# Altium project MAIN_BOARD.PrjPcb
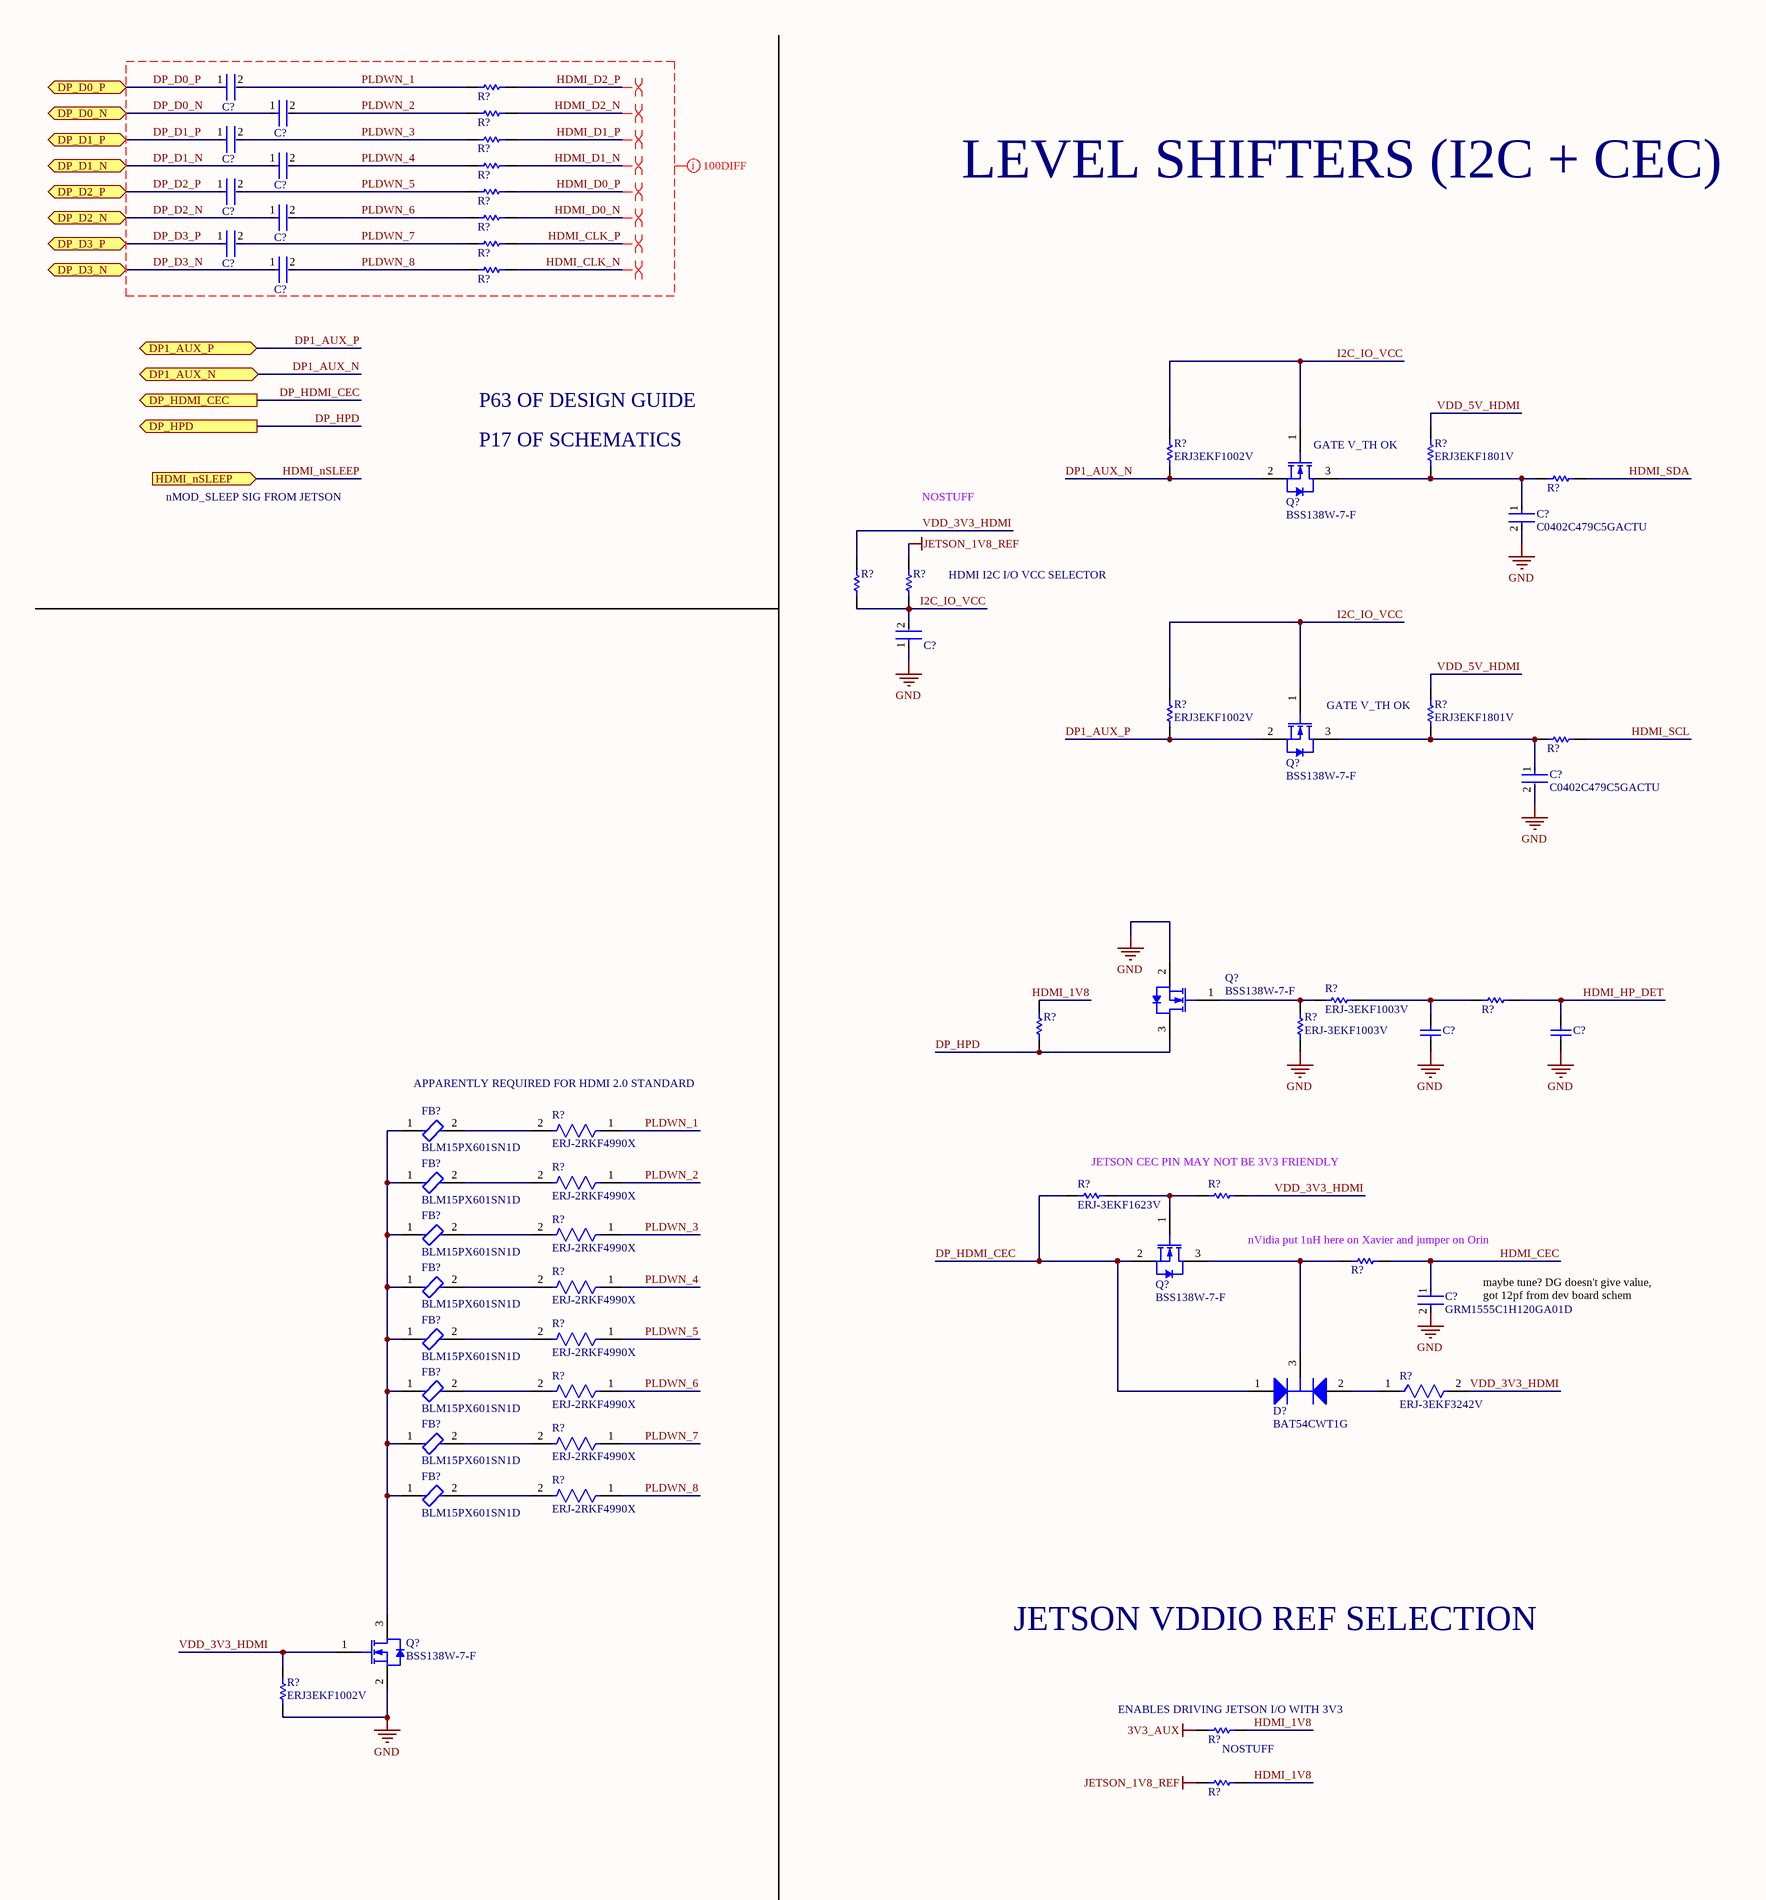
[diagram p0: HDMI.SchDoc, left]
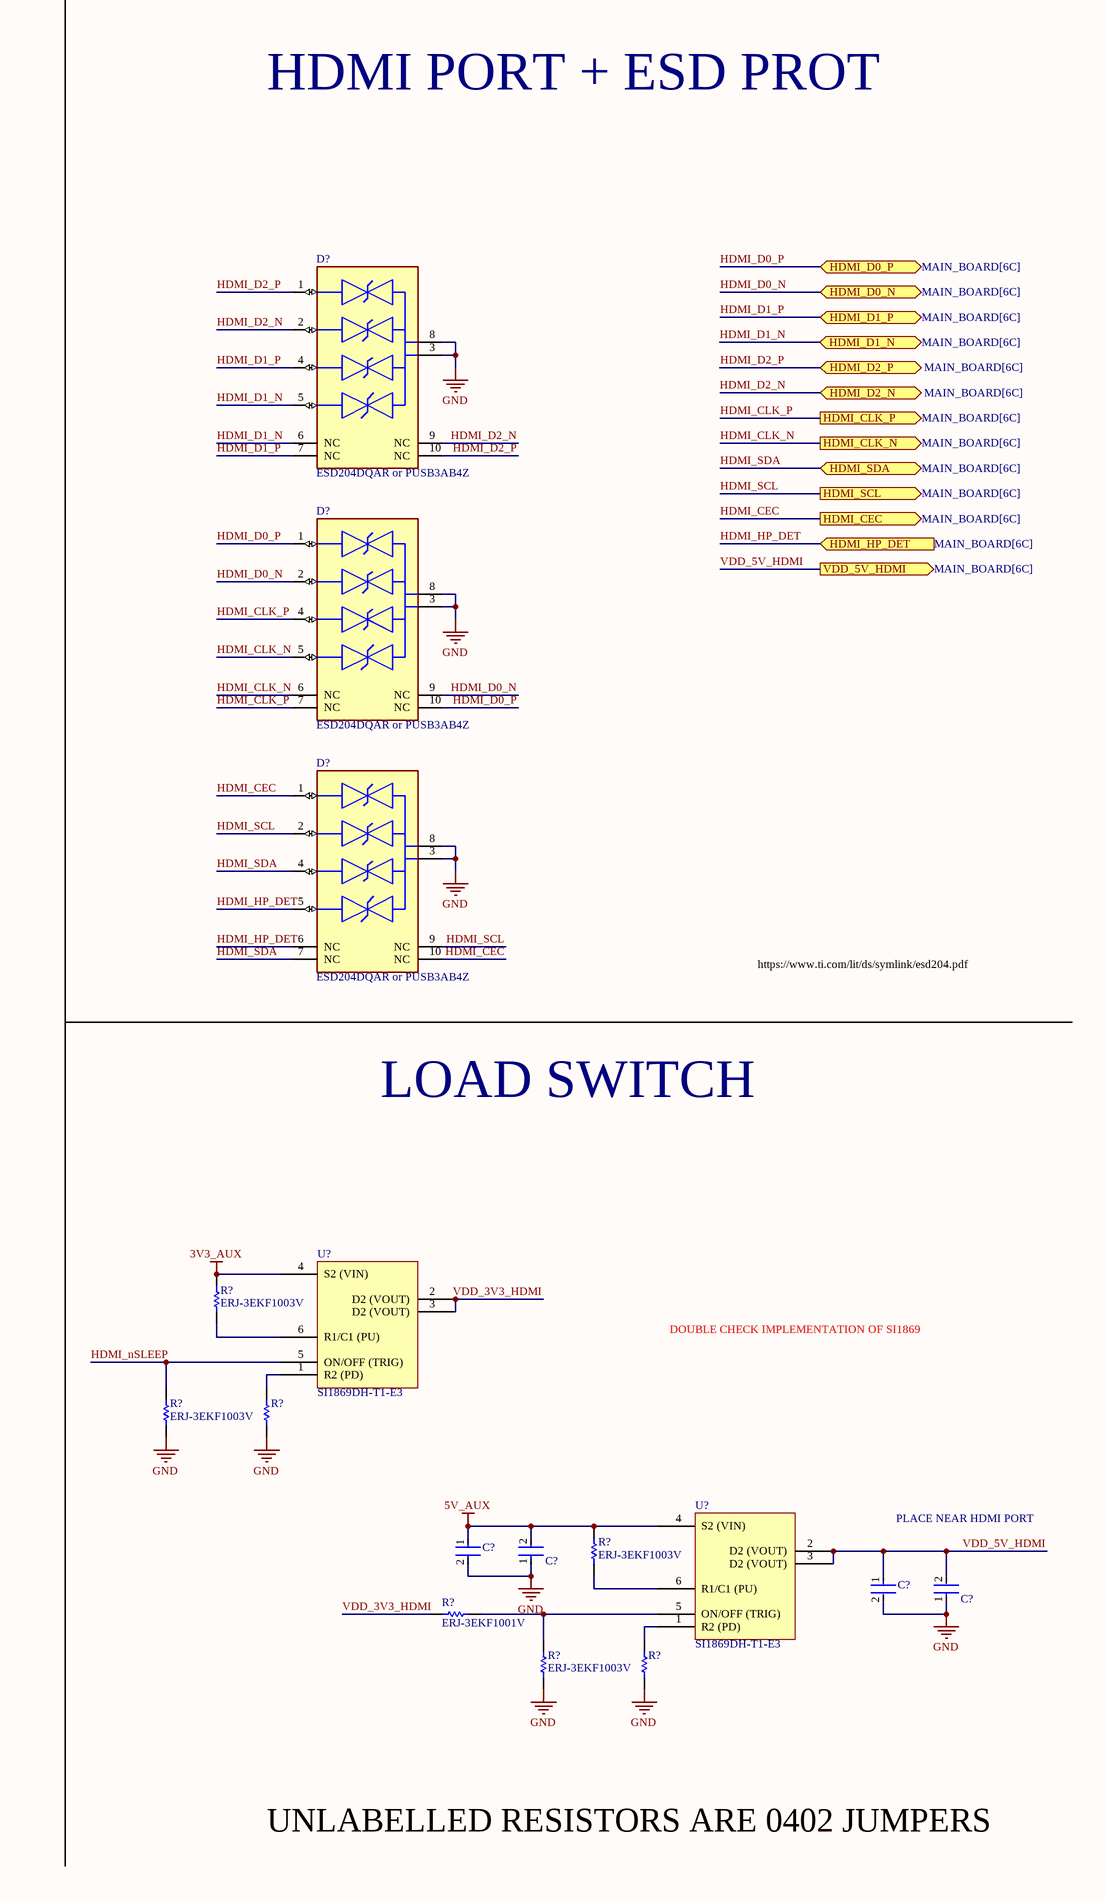
[diagram p1: HDMI.SchDoc, right]
3 sheets, 196 parts. Net scope: flat (ports and power ports of the same name join across sheets).
Board file: ADAS_ECU_MB_revA.PcbDoc
Sheets:
  HDMI.SchDoc
  GMSL_DESERIALIZER.SchDoc
  GMSL_SERIALIZER.SchDoc

## Sheet HDMI.SchDoc
size A2; SheetNumber: 3; SheetTotal: 10

### Parts
(Parts that share a designator on the sheet are numbered #1, #2 ... from top to bottom, then left to right.)
C?#1  C1005X7R1H104K050BB  [FP-C1005-050-0_05-IPC_C]  (value not drawn)
C?#2  C1005X7R1H104K050BB  [FP-C1005-050-0_05-IPC_C]  (value not drawn)
C?#3  C1005X7R1H104K050BB  [FP-C1005-050-0_05-IPC_C]  (value not drawn)
C?#4  C1005X7R1H104K050BB  [FP-C1005-050-0_05-IPC_C]  (value not drawn)
C?#5  C1005X7R1H104K050BB  [FP-C1005-050-0_05-IPC_C]  (value not drawn)
C?#6  C1005X7R1H104K050BB  [FP-C1005-050-0_05-IPC_C]  (value not drawn)
C?#7  C1005X7R1H104K050BB  [FP-C1005-050-0_05-IPC_C]  (value not drawn)
C?#8  C1005X7R1H104K050BB  [FP-C1005-050-0_05-IPC_C]  (value not drawn)
C?#9  C0402C479C5GACTU  [FP-C0402-BB-MFG]
C?#10  C1005X7R1H104K050BB  [FP-C1005-050-0_05-IPC_C]  (value not drawn)
C?#11  C0402C479C5GACTU  [FP-C0402-BB-MFG]
C?#12  C0402C221K5RAC7867  [CAPC1005X60X30NL05T10]  (value not drawn)
C?#13  C0402C221K5RAC7867  [CAPC1005X60X30NL05T10]  (value not drawn)
C?#14  GRM1555C1H120GA01D  [FP-GRM155-0_05-MFG]
C?#15  GRM188R60J106ME47D  [FP-GRM188-0_1-e0_2_0_55-IPC_A]  (value not drawn)
C?#16  C1005X7R1H104K050BB  [FP-C1005-050-0_05-IPC_C]  (value not drawn)
C?#17  GRM188R60J106ME47D  [FP-GRM188-0_1-e0_2_0_55-IPC_A]  (value not drawn)
C?#18  C1005X7R1H104K050BB  [FP-C1005-050-0_05-IPC_C]  (value not drawn)
D?#1  ESD204DQAR or PUSB3AB4Z  [FP-DQA0010A-MFG]
D?#2  ESD204DQAR or PUSB3AB4Z  [FP-DQA0010A-MFG]
D?#3  ESD204DQAR or PUSB3AB4Z  [FP-DQA0010A-MFG]
D?#4  BAT54CWT1G  [ONSC-SOT-323-3-419-04_V]
FB?#1  BLM15PX601SN1D  [FP-BLM15-0_05-MFG]
FB?#2  BLM15PX601SN1D  [FP-BLM15-0_05-MFG]
FB?#3  BLM15PX601SN1D  [FP-BLM15-0_05-MFG]
FB?#4  BLM15PX601SN1D  [FP-BLM15-0_05-MFG]
FB?#5  BLM15PX601SN1D  [FP-BLM15-0_05-MFG]
FB?#6  BLM15PX601SN1D  [FP-BLM15-0_05-MFG]
FB?#7  BLM15PX601SN1D  [FP-BLM15-0_05-MFG]
FB?#8  BLM15PX601SN1D  [FP-BLM15-0_05-MFG]
Q?#1  BSS138W-7-F  [DIOD-SOT323-3_V]
Q?#2  BSS138W-7-F  [DIOD-SOT323-3_V]
Q?#3  BSS138W-7-F  [DIOD-SOT323-3_V]
Q?#4  BSS138W-7-F  [DIOD-SOT323-3_V]
Q?#5  BSS138W-7-F  [DIOD-SOT323-3_V]
R?#1  0402 JUMPER  [RESC1005X40X25ML05T05]  (value not drawn)
R?#2  0402 JUMPER  [RESC1005X40X25ML05T05]  (value not drawn)
R?#3  0402 JUMPER  [RESC1005X40X25ML05T05]  (value not drawn)
R?#4  0402 JUMPER  [RESC1005X40X25ML05T05]  (value not drawn)
R?#5  0402 JUMPER  [RESC1005X40X25ML05T05]  (value not drawn)
R?#6  0402 JUMPER  [RESC1005X40X25ML05T05]  (value not drawn)
R?#7  0402 JUMPER  [RESC1005X40X25ML05T05]  (value not drawn)
R?#8  0402 JUMPER  [RESC1005X40X25ML05T05]  (value not drawn)
R?#9  ERJ3EKF1002V  [RESC1609X55X30LL15T15]
R?#10  ERJ3EKF1801V  [RESC1608X55X30LL15T15]
R?#11  0402 JUMPER  [RESC1005X40X25ML05T05]  (value not drawn)
R?#12  0402 JUMPER  [RESC1005X40X25ML05T05]  (value not drawn)
R?#13  0402 JUMPER  [RESC1005X40X25ML05T05]  (value not drawn)
R?#14  ERJ3EKF1002V  [RESC1609X55X30LL15T15]
R?#15  ERJ3EKF1801V  [RESC1608X55X30LL15T15]
R?#16  0402 JUMPER  [RESC1005X40X25ML05T05]  (value not drawn)
R?#17  ERJ-3EKF1003V  [RESC1608X55X30ML15T15]
R?#18  0402 JUMPER  [RESC1005X40X25ML05T05]  (value not drawn)
R?#19  ERJ3EKF1002V  [RESC1609X55X30LL15T15]  (value not drawn)
R?#20  ERJ-3EKF1003V  [RESC1608X55X30ML15T15]
R?#21  ERJ-2RKF4990X  [FP-ERJ2RK-MFG]
R?#22  ERJ-2RKF4990X  [FP-ERJ2RK-MFG]
R?#23  ERJ-3EKF1623V  [RESC1608X55X30ML15T15]
R?#24  0402 JUMPER  [RESC1005X40X25ML05T05]  (value not drawn)
R?#25  ERJ-2RKF4990X  [FP-ERJ2RK-MFG]
R?#26  0402 JUMPER  [RESC1005X40X25ML05T05]  (value not drawn)
R?#27  ERJ-2RKF4990X  [FP-ERJ2RK-MFG]
R?#28  ERJ-2RKF4990X  [FP-ERJ2RK-MFG]
R?#29  ERJ-2RKF4990X  [FP-ERJ2RK-MFG]
R?#30  ERJ-3EKF3242V  [FP-ERJ3EK-MFG]
R?#31  ERJ-3EKF1003V  [RESC1608X55X30ML15T15]
R?#32  ERJ-2RKF4990X  [FP-ERJ2RK-MFG]
R?#33  ERJ-2RKF4990X  [FP-ERJ2RK-MFG]
R?#34  0402 JUMPER  [RESC1005X40X25ML05T05]  (value not drawn)
R?#35  ERJ-3EKF1003V  [RESC1608X55X30ML15T15]
R?#36  ERJ-3EKF1003V  [RESC1608X55X30ML15T15]
R?#37  ERJ3EKF1002V  [RESC1609X55X30LL15T15]
R?#38  0402 JUMPER  [RESC1005X40X25ML05T05]  (value not drawn)
R?#39  ERJ-3EKF1001V  [RESC1608X55X30LL15T15]
R?#40  0402 JUMPER  [RESC1005X40X25ML05T05]  (value not drawn)
R?#41  0402 JUMPER  [RESC1005X40X25ML05T05]  (value not drawn)
R?#42  ERJ-3EKF1003V  [RESC1608X55X30ML15T15]
U?#1  SI1869DH-T1-E3  [SOT65P242X110-6N]
U?#2  SI1869DH-T1-E3  [SOT65P242X110-6N]

### Ports
DP1_AUX_N (bidir, see MAIN_BOARD[5C]), DP1_AUX_P (bidir, see MAIN_BOARD[5C]), DP_D0_N (bidir, see MAIN_BOARD[5C]), DP_D0_P (bidir, see MAIN_BOARD[5C]), DP_D1_N (bidir, see MAIN_BOARD[5C]), DP_D1_P (bidir, see MAIN_BOARD[5C]), DP_D2_N (bidir, see MAIN_BOARD[5C]), DP_D2_P (bidir, see MAIN_BOARD[5C]), DP_D3_N (bidir, see MAIN_BOARD[5C]), DP_D3_P (bidir, see MAIN_BOARD[5C]), DP_HDMI_CEC (out, see MAIN_BOARD[5C]), DP_HPD (out, see MAIN_BOARD[5C]), HDMI_CEC (out, see MAIN_BOARD[6C]), HDMI_CLK_N (out, see MAIN_BOARD[6C]), HDMI_CLK_P (out, see MAIN_BOARD[6C]), HDMI_D0_N (bidir, see MAIN_BOARD[6C]), HDMI_D0_P (bidir, see MAIN_BOARD[6C]), HDMI_D1_N (bidir, see MAIN_BOARD[6C]), HDMI_D1_P (bidir, see MAIN_BOARD[6C]), HDMI_D2_N (bidir, see MAIN_BOARD[6C]), HDMI_D2_P (bidir, see MAIN_BOARD[6C]), HDMI_HP_DET (in, see MAIN_BOARD[6C]), HDMI_nSLEEP (in, see MAIN_BOARD[5C]), HDMI_SCL (out, see MAIN_BOARD[6C]), HDMI_SDA (bidir, see MAIN_BOARD[6C]), VDD_5V_HDMI (out, see MAIN_BOARD[6C])

### Nets
3V3_AUX: R?#31.2 R?#38.1 U?#1.4(S2_(VIN))
5V_AUX: C?#15.1 C?#16.2 R?#36.2 U?#2.4(S2_(VIN))
GND: C?#9.2 C?#10.1 C?#11.2 C?#12.1 C?#13.1 C?#14.2 C?#15.2 C?#16.1 C?#17.2 C?#18.1 D?#1.3(GND) D?#1.8(GND) D?#2.3(GND) D?#2.8(GND) D?#3.3(GND) D?#3.8(GND) Q?#3.2(S) Q?#5.2(S) R?#20.1 R?#34.2 R?#35.1 R?#37.1 R?#41.2 R?#42.1
JETSON_1V8_REF: R?#13.2 R?#40.1
DP1_AUX_N: Q?#1.2(S) R?#9.1 ; port DP1_AUX_N
DP1_AUX_P: Q?#2.2(S) R?#14.1 ; port DP1_AUX_P
DP_D0_N: C?#2.1 ; port DP_D0_N
DP_D0_P: C?#1.1 ; port DP_D0_P
DP_D1_N: C?#4.1 ; port DP_D1_N
DP_D1_P: C?#3.1 ; port DP_D1_P
DP_D2_N: C?#6.1 ; port DP_D2_N
DP_D2_P: C?#5.1 ; port DP_D2_P
DP_D3_N: C?#8.1 ; port DP_D3_N
DP_D3_P: C?#7.1 ; port DP_D3_P
DP_HDMI_CEC: D?#4.1(A1) Q?#4.2(S) R?#23.1 ; port DP_HDMI_CEC
DP_HPD: Q?#3.3(D) R?#19.1 ; port DP_HPD
HDMI_1V8: R?#19.2 R?#38.2 R?#40.2
HDMI_CEC: C?#14.1 D?#3.1(IO1) D?#3.10(NC) R?#26.2 ; port HDMI_CEC
HDMI_CLK_N: D?#2.5(IO4) D?#2.6(NC) R?#8.2 ; port HDMI_CLK_N
HDMI_CLK_P: D?#2.4(IO3) D?#2.7(NC) R?#7.2 ; port HDMI_CLK_P
HDMI_D0_N: D?#2.2(IO2) D?#2.9(NC) R?#6.2 ; port HDMI_D0_N
HDMI_D0_P: D?#2.1(IO1) D?#2.10(NC) R?#5.2 ; port HDMI_D0_P
HDMI_D1_N: D?#1.5(IO4) D?#1.6(NC) R?#4.2 ; port HDMI_D1_N
HDMI_D1_P: D?#1.4(IO3) D?#1.7(NC) R?#3.2 ; port HDMI_D1_P
HDMI_D2_N: D?#1.2(IO2) D?#1.9(NC) R?#2.2
HDMI_D2_P: D?#1.1(IO1) D?#1.10(NC) R?#1.2 ; port HDMI_D2_P
HDMI_HP_DET: C?#13.2 D?#3.5(IO4) D?#3.6(NC) R?#18.2 ; port HDMI_HP_DET
HDMI_nSLEEP: R?#35.2 U?#1.5(ON/OFF_(TRIG)) ; port HDMI_nSLEEP
HDMI_SCL: D?#3.2(IO2) D?#3.9(NC) R?#16.2 ; port HDMI_SCL
HDMI_SDA: D?#3.4(IO3) D?#3.7(NC) R?#11.2 ; port HDMI_SDA
I2C_IO_VCC: C?#10.2 Q?#1.1(G) Q?#2.1(G) R?#9.2 R?#12.1 R?#13.1 R?#14.2
PLDWN_1: C?#1.2 R?#1.1 R?#21.1
PLDWN_2: C?#2.2 R?#2.1 R?#22.1
PLDWN_3: C?#3.2 R?#3.1 R?#25.1
PLDWN_4: C?#4.2 R?#4.1 R?#27.1
PLDWN_5: C?#5.2 R?#5.1 R?#28.1
PLDWN_6: C?#6.2 R?#6.1 R?#29.1
PLDWN_7: C?#7.2 R?#7.1 R?#32.1
PLDWN_8: C?#8.2 R?#8.1 R?#33.1
VDD_3V3_HDMI: Q?#5.1(G) R?#12.2 R?#24.1 R?#30.2 R?#37.2 R?#39.1 U?#1.2(D2_(VOUT)) U?#1.3(D2_(VOUT))
VDD_5V_HDMI: C?#17.1 C?#18.2 R?#10.2 R?#15.2 U?#2.2(D2_(VOUT)) U?#2.3(D2_(VOUT)) ; port VDD_5V_HDMI
NetC?#9_1: C?#9.1 Q?#1.3(D) R?#10.1 R?#11.1
NetC?#11_1: C?#11.1 Q?#2.3(D) R?#15.1 R?#16.1
NetC?#12_2: C?#12.2 R?#17.2 R?#18.1
NetD?#4_2: D?#4.2(A2) R?#30.1
NetD?#4_3: D?#4.3(K) Q?#4.3(D) R?#26.1
NetFB?#1_1: FB?#1.1 FB?#2.1 FB?#3.1 FB?#4.1 FB?#5.1 FB?#6.1 FB?#7.1 FB?#8.1 Q?#5.3(D)
NetFB?#1_2: FB?#1.2 R?#21.2
NetFB?#2_2: FB?#2.2 R?#22.2
NetFB?#3_2: FB?#3.2 R?#25.2
NetFB?#4_2: FB?#4.2 R?#27.2
NetFB?#5_2: FB?#5.2 R?#28.2
NetFB?#6_2: FB?#6.2 R?#29.2
NetFB?#7_2: FB?#7.2 R?#32.2
NetFB?#8_2: FB?#8.2 R?#33.2
NetQ?#3_1: Q?#3.1(G) R?#17.1 R?#20.2
NetQ?#4_1: Q?#4.1(G) R?#23.2 R?#24.2
NetR?#31_1: R?#31.1 U?#1.6(R1/C1_(PU))
NetR?#34_1: R?#34.1 U?#1.1(R2_(PD))
NetR?#36_1: R?#36.1 U?#2.6(R1/C1_(PU))
NetR?#39_2: R?#39.2 R?#42.2 U?#2.5(ON/OFF_(TRIG))
NetR?#41_1: R?#41.1 U?#2.1(R2_(PD))

### Layout directives
differential pair; differential pair class 100DIFF: HDMI_CLK_N, HDMI_CLK_P, HDMI_D0_N, HDMI_D0_P, HDMI_D1_N, HDMI_D1_P, HDMI_D2_N, HDMI_D2_P
net class 100DIFF: DP_D0_N, DP_D0_P, DP_D1_N, DP_D1_P, DP_D2_N, DP_D2_P, DP_D3_N, DP_D3_P, HDMI_CLK_N, HDMI_CLK_P, HDMI_D0_N, HDMI_D0_P, HDMI_D1_N, HDMI_D1_P, HDMI_D2_N, HDMI_D2_P, PLDWN_1, PLDWN_2, PLDWN_3, PLDWN_4, PLDWN_5, PLDWN_6, PLDWN_7, PLDWN_8

### Notes on the sheet
- HDMI PORT + ESD PROT
- LEVEL SHIFTERS (I2C + CEC)
- P63 OF DESIGN GUIDE
- nMOD_SLEEP SIG FROM JETSON
- P17 OF SCHEMATICS
- NOSTUFF
- (near Q?#1) GATE V_TH OK
- HDMI I2C I/O VCC SELECTOR
- (near Q?#2) GATE V_TH OK
- APPARENTLY REQUIRED FOR HDMI 2.0 STANDARD
- https://www.ti.com/lit/ds/symlink/esd204.pdf
- (near R?#23) JETSON CEC PIN MAY NOT BE 3V3 FRIENDLY
- LOAD SWITCH
- (near R?#26) nVidia put 1nH here on Xavier and jumper on Orin
- maybe tune? DG doesn't give value, got 12pf from dev board schem
- DOUBLE CHECK IMPLEMENTATION OF SI1869
- JETSON VDDIO REF SELECTION
- PLACE NEAR HDMI PORT
- (near R?#38) ENABLES DRIVING JETSON I/O WITH 3V3
- (near R?#38) NOSTUFF
- UNLABELLED RESISTORS ARE 0402 JUMPERS
- Labels drawn without touching a wire or pin: HDMI_D2_N

### Library data of the parts
C?#1-C?#8 C?#10 C?#16 C?#18 = CMP-2000-05393-2: Multilayer Ceramic Capacitors 100nF ±10% 50V X7R SMD 0402; Voltage: 50V; Dielectric Material: Ceramic; Min Operating Temperature: -55°C; Depth: 0.5mm; Radiation Hardening: No; RoHS Compliant: Yes; Voltage Rating (DC): 50V; Lead Free: Lead Free; Resistor Type: Ceramic; Height: 0.5mm; Dielectric: X7R; Thickness: 0.022inch; Case/Package: 0402; Case Code (Metric): 1005; Termination: SMD/SMT; Capacitance: 100nF; Packaging: Tape and Reel; Max Operating Temperature: 125°C; Mount: Surface Mount; Package Quantity: 1; Width: 0.02inch; Weight: 2.3E-05oz; Voltage Rating: 50V; Tolerance: 10%; Construction: Flat; Case Code (Imperial): 0402; Length: 1mm; REACH SVHC: No SVHC; Series: C
C?#9 C?#11 = CMP-2008-03310-2: CAP CER 4.7PF 50V NP0 0402; Manufacturer: Kemet; Material: Ceramic; Tolerance: 0.25 pF; Temperature Coefficient: 15%; Temperature Characteristic: C0G; Manufacturer Part Number: C0402C479C5GACTU; Lead Free: Yes; Device Class L1: Passive Components; ComponentLink2Description: Datasheet; Temperature: -55°C to +125°C; Digikey Description: CAP CER 4.7PF 50V NP0 0402; Ipc Land Pattern Name: CAPC10050X50; ComponentLink2URL: https://content.kemet.com/datasheets/KEM_C1002_X7R_SMD.pdf; Octopart: https://octopart.com/c0402c479c5gactu-kemet-9144199; Mouser Description: Multilayer Ceramic Capacitors MLCC - SMD/SMT 50volts 4.7pF C0G .25pF; Automotive: No; Voltage Rating: 50 V; Device Class L3: Ceramic Capacitors; Capacitance: 4.7 pF; Category: Cap; Value: 4.7 pF; Package: C0402-BB; Height: 0.55mm; Temperature Range Low: -55°C; RoHS: TRUE; Device Class L2: Capacitors; Temperature Range High: +125°C
C?#12 C?#13 = CMP-2008-03137-2: Manufacturer: Kemet; Part Number: C0402C221K5RAC7867
C?#14 = CMP-2008-03945-2: CAP CER 12PF 50V C0G/NP0 0402; Tolerance: 2%; Dielectric: C0G; Material: Ceramic; Termination: SMD/SMT; Mount: Surface Mount; REACH SVHC: No SVHC; Depth: 0.5mm; Case Code (Metric): 1005; Voltage Rating: 50V; Height: 0.5mm; Voltage Rating (DC): 50V; Case Code (Imperial): 0402; Package Quantity: 10000; Construction: Flat; Thickness: 0.022inch; Length: 1mm; Min Operating Temperature: -55°C; Width: 0.5mm; Lead Free: Lead Free; Capacitance: 12pF; Case/Package: 0402; Packaging: Tape and Reel; Series: GRM; Voltage: 50V; Radiation Hardening: No; Max Operating Temperature: 125°C
C?#15 C?#17 = CMP-2006-02792-2: Chip Multilayer Ceramic Capacitors for General Purpose, 0603, 10uF, X5R, 15%, 20%, 6.3V; Packaging: Tape and Reel; Voltage Rating (DC): 6.3V; Width: 0.031inch; Termination: SMD/SMT; Dielectric: X5R; Package Quantity: 4000; Voltage Rating: 6.3V; Capacitance: 10uF; Case/Package: 0603; Min Operating Temperature: -55°C; Voltage: 6.3V; Length: 1.6mm; Thickness: 0.035inch; Lead Free: Lead Free; Depth: 0.8mm; Case Code (Imperial): 0603; Max Operating Temperature: 85°C; Material: Ceramic; Height: 0.8mm; Tolerance: 20%; Mount: Surface Mount; REACH SVHC: No SVHC; Radiation Hardening: No; Case Code (Metric): 1608
D?#1-D?#3 = CMP-04989-000002-1: 4-CHANNEL LOW-CAPACITANCE SURGE; Manufacturer: Texas Instruments; Value: 0.55pF; Reverse Standoff Voltage: 3.6V; Standoff Height: 0mm; Breakdown Voltage: 5.5V; Peak Pulse Current: 5.5A; Clamping Voltage: 11.5V; Direction: Bidirectional; Peak Pulse Power: 50W; Number Of Channels: 4; Ambient Temperature Range High: +125°C; ComponentLink2Description: Datasheet; Height: 0.55mm; Lead Free: Yes; Device Class L3: unset; Temperature Range High: +125°C; Temperature Range Low: -40°C; Package: DQA0010A; Temperature: -40°C to +125°C; Capacitance: 0.55pF; RoHS: TRUE; Mouser Description: 4-Channel Low-Capacitance Surge and ESD Protection Diode 10-USON -40 to 125; Category: Diode; Device Class L1: Circuit Protection; Octopart: https://octopart.com/esd204dqar-texas+instruments-89917476; Device Class L2: TVS Diodes; Ambient Temperature Range Low: -40°C; Manufacturer Part Number: ESD204DQAR; ComponentLink2URL: http://www.ti.com/lit/ds/symlink/esd204.pdf; Automotive: No; Digikey Description: 4-CHANNEL LOW-CAPACITANCE SURGE
D?#4 = CMP-1055-00557-1: Dual Series Cathode Schottky Barrier Diodes, 3-Pin SOT-323, Pb-Free, Tape and Reel; Manufacturer: On Semiconductor; Configuration: Common Cathode; IFSM Max (A): 0.6; trr Max (ns): 5; ComponentLink2Description: Datasheet; Packing: Tape and Reel; ComponentLink3Description: Package Specification; Mounting Technology: Surface Mount; PartNumber: BAT54CWT1G; PackageVersion: Rev. N, 11/2008; RoHS: TRUE; ComponentLink3URL: http://www.onsemi.com/pub_link/Collateral/419-04.PDF; ComponentLink2URL: http://www.onsemi.cn/pub_link/Collateral/BAT54CWT1-D.PDF; PackageReference: SOT-323-3-419-04; ComponentLink1URL: http://www.onsemi.com/; ComponentLink1Description: Manufacturer URL; DatasheetVersion: Rev. 7; PackageDescription: 3-Pin Small Outline Transistor, Body 2 x 1.25 mm, Pitch 0.65 mm
FB?#1-FB?#8 = CMP-0686-00252-4: Chip Ferrite Bead, 0402, 600Ω @ 100MHz, 0.23Ω, 25%, 900mA; Number of Circuits: 1; Impedance: 600R; DC Resistance (DCR): 230mR; Material: Steel; Length: 1mm; Package Quantity: 10000; Height: 0.5mm; Width: 0.5mm; Max DC Current: 900mA; Number of Lines: 1; Termination: SMD/SMT; Packaging: Tape and Reel; Lead Free: Lead Free; Min Operating Temperature: -55°C; Max Operating Temperature: 125°C; Max Current Rating: 900mA; Case Code (Imperial): 0402; Number of Pins: 2; Current Rating: 900mA; Test Frequency: 100MHz; Case/Package: 0402; Tolerance: 25%; Case Code (Metric): 1005
Q?#1-Q?#5 = CMP-2000-05968-1: N-Channel Enhancement Mode Mosfet, 50 V, 200 mA, -55 to 150 degC, 6-Pin SOT-323, RoHS, Tape and Reel; Typical Turn-Off Delay Time: 20ns; Number of Channels: 1Channel; Type: EnhancementModeFieldEffectTransistor; Brand: DiodesIncorporated; Vds - Drain-Source Breakdown Voltage: 75V; Vgs - Gate-Source Voltage: 20V; Rds On - Drain-Source Resistance: 1.4Ohms; Transistor Type: 1N-Channel; Configuration: Single; Unit Weight: 0.000212oz; Pd - Power Dissipation: 200mW; Id - Continuous Drain Current: 200mA; Forward Transconductance - Min: 0.1S; Manufacturer URL: http://www.diodes.com/; Series: BSS138; Package Description: 3-Pin Small Outline Transistor, Body 2 x 1.25 mm, Pitch 0.65 mm; Mounting Technology: SurfaceMount; Product Category: MOSFET; RoHS: True; Maximum Operating Temperature: +150C; Height: 1mm; Length: 2.2mm; Technology: Si; Width: 1.35mm; Datasheet URL: http://www.diodes.com/_files/datasheets/ds30206.pdf; Manufacturer: DiodesIncorporated; Package / Case: SOT-323-3; Typical Turn-On Delay Time: 20ns; Transistor Polarity: N-Channel; Factory Pack Quantity: 3000; Packaging: Reel; Product: MOSFETSmallSignal; Datasheet Version: Rev. 11-2, 09/2013; Package Reference: SOT323; Minimum Operating Temperature: -55C; Mounting Style: SMD/SMT; Channel Mode: Enhancement
R?#1-R?#8 R?#11-R?#13 R?#16 R?#18 R?#24 R?#26 R?#34 R?#38 R?#40 R?#41 = CMP-009-00118-2: READ THE NAME; Pins: 2; Component Type: Standard; Design Item ID: CMP-009-00206-2; Source: 0402jump.SchLib
R?#9 R?#14 R?#19 R?#37 = CMP-1012-00623-3: Chip Resistor, 10 KOhm, +/- 1%, 0.1 W, -55 to 155 degC, 0603 (1608 Metric), RoHS, Tape and Reel; Manufacturer: Panasonic; Voltage Rating: 75V; Case\/Package: 0603; Power Rating: 100mW; Resistance: 10KOhm; Temperature Coefficient: 100ppm\/degreesC; Number of Pins: 2; Package Reference: 603; Depth: 0.8mm; Mount: SurfaceMount; Package Description: 2-Pin Surface Mount Device, Body 1.6 x 0.85 mm; Datasheet Version: 02/2017; Length: 1.6mm; Lead Free: LeadFree; Height: 0.45mm; Number of Terminations: 2; Max Power Dissipation: 100mW; Min Operating Temperature: -55degC; Datasheet URL: https://industrial.panasonic.com/cdbs/www-data/pdf/RDA0000/AOA0000C304.pdf; Termination: SMD/SMT; Case Code (Metric): 1608; Case Code (Imperial): 0603; Tolerance: 1%; Max Operating Temperature: 155degC; RoHSCompliant: true; Voltage Rating (DC): 75V; Radiation Hardening: No; Packaging: TapeandReel; Composition: ThickFilm; Mounting Technology: SurfaceMount; Manufacturer URL: http://www.panasonic.com/; Width: 0.031inch; REACH SVHC: NoSVHC; Contact Plating: Tin; Military Standard: Not; Package Quantity: 1
R?#10 R?#15 = CMP-2000-00389-1: MODIFIED P/N; Manufacturer: Panasonic; Part Number: ERJ3EKF2701V
R?#17 R?#20 R?#31 R?#35 R?#36 R?#42 = CMP-2000-00182-1: Manufacturer: Panasonic; Part Number: ERJ-3EKF1003V
R?#21 R?#22 R?#25 R?#27-R?#29 R?#32 R?#33 = CMP-2002-00965-2: RES SMD 499 OHM 1% 1/10W 0402; Temperature Coefficient: 100ppm/°C; Max Power Dissipation: 100mW; Voltage Rating (DC): 50V; Resistance: 499R; Technology: THICK FILM; Min Operating Temperature: -55°C; Package Quantity: 1; Width: 0.02inch; Contact Plating: Tin; Tolerance: 1%; Features: Automotive AEC-Q200; Resistance Tolerance: 1%; Size Code: 0402; Military Standard: Not; Resistor Type: Thick Film; Case/Package: 0402; Mount: Surface Mount; Case Code (Metric): 1005; RoHS Compliant: Yes; REACH SVHC: No SVHC; Number of Terminations: 2; Construction: Rectangular; Packaging: Tape and Reel; Series: ERJ; Lead Free: Lead Free; Length: 1mm; Voltage Rating: 50V; Termination: SMD/SMT; Max Operating Temperature: 155°C; Case Code (Imperial): 0402; Height: 0.35mm; Power Rating: 100mW; Depth: 0.5mm
R?#23 = CMP-1012-00758-2: Manufacturer: Panasonic; Part Number: ERJ-3EKF1623V
R?#30 = CMP-2000-00433-2: RES SMD 32.4K OHM 1% 1/10W 0603; Voltage Rating: 75V; Max Power Dissipation: 100mW; Temperature Coefficient: 100ppm/°C; Resistance: 32.4kR; Voltage Rating (DC): 50V; Technology: THICK FILM; Tolerance: 1%; Features: Automotive AEC-Q200; Width: 0.8mm; Case/Package: 0603; Min Operating Temperature: -55°C; Power Rating: 100mW; Contact Plating: Tin; Case Code (Imperial): 0603; Number of Terminations: 2; Lead Free: Lead Free; Length: 1.6mm; Series: ERJ; Packaging: Tape and Reel; RoHS Compliant: Yes; Military Standard: Not; Termination: SMD/SMT; Case Code (Metric): 1608; Max Operating Temperature: 155°C; Package Quantity: 1; Mount: Surface Mount; Resistor Type: Thick Film; Construction: Rectangular; Height: 0.45mm; Resistance Tolerance: 1%; Depth: 0.8mm; Radiation Hardening: No
R?#39 = CMP-2000-00180-1: Manufacturer: Panasonic; Part Number: ERJ-3EKF1001V
U?#1 U?#2 = CMP-019-00043-2: Power Supply Support Circuit, Adjustable, 1 Channel, PDSO6; Max Supply Voltage: 20V; Min Supply Voltage: 1.8V; Case/Package: TSSOP; Pins: 6; RoHS Compliant: Yes

## Sheet GMSL_DESERIALIZER.SchDoc
size C; SheetNumber: 6; SheetTotal: 10
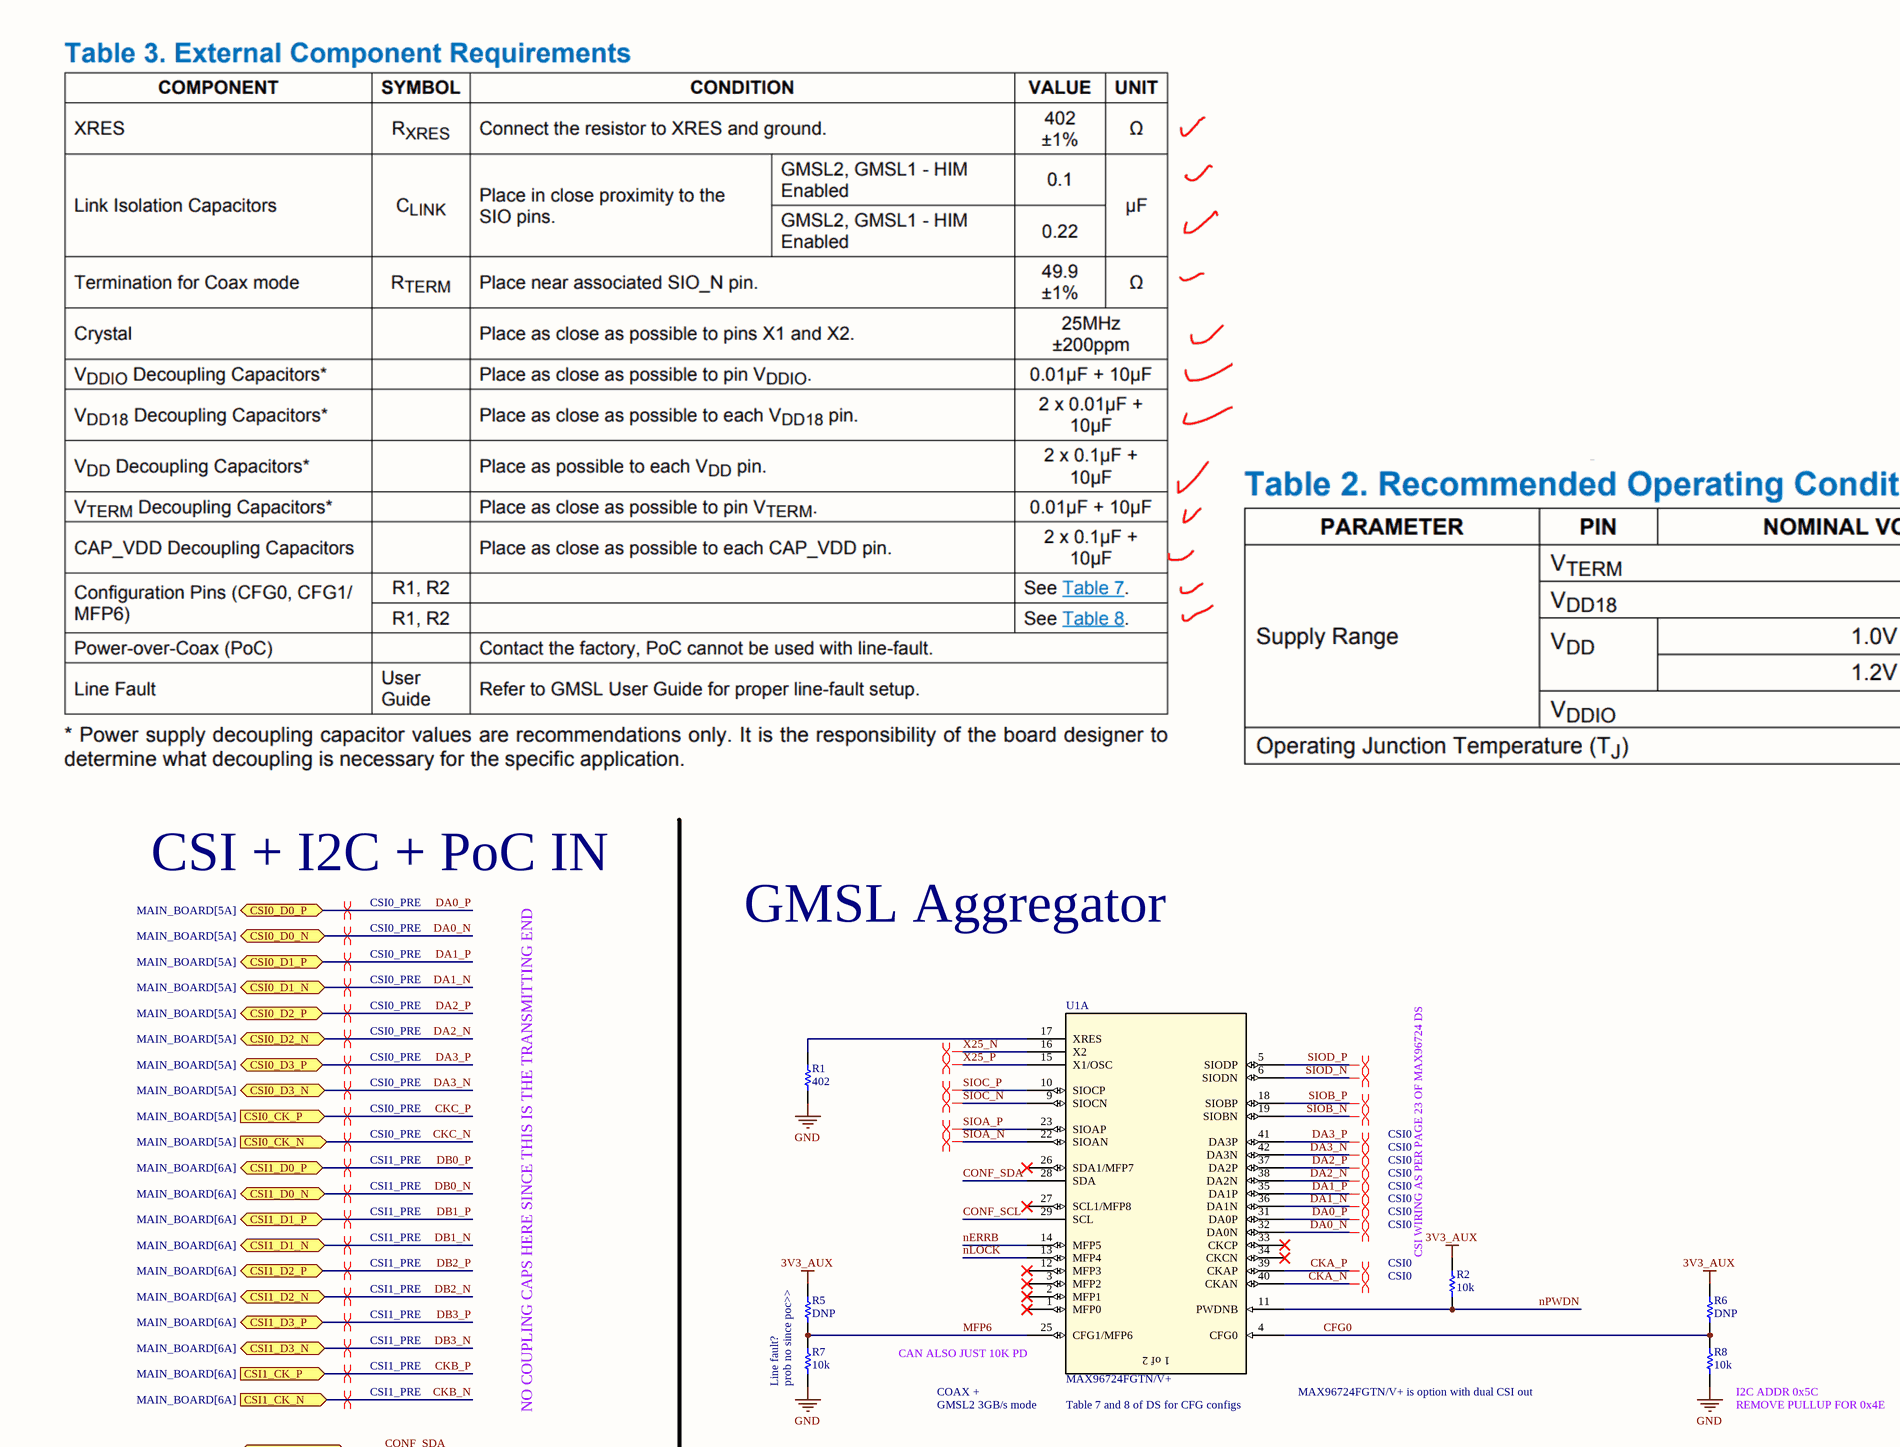
[diagram p2: GMSL_DESERIALIZER.SchDoc, top left]
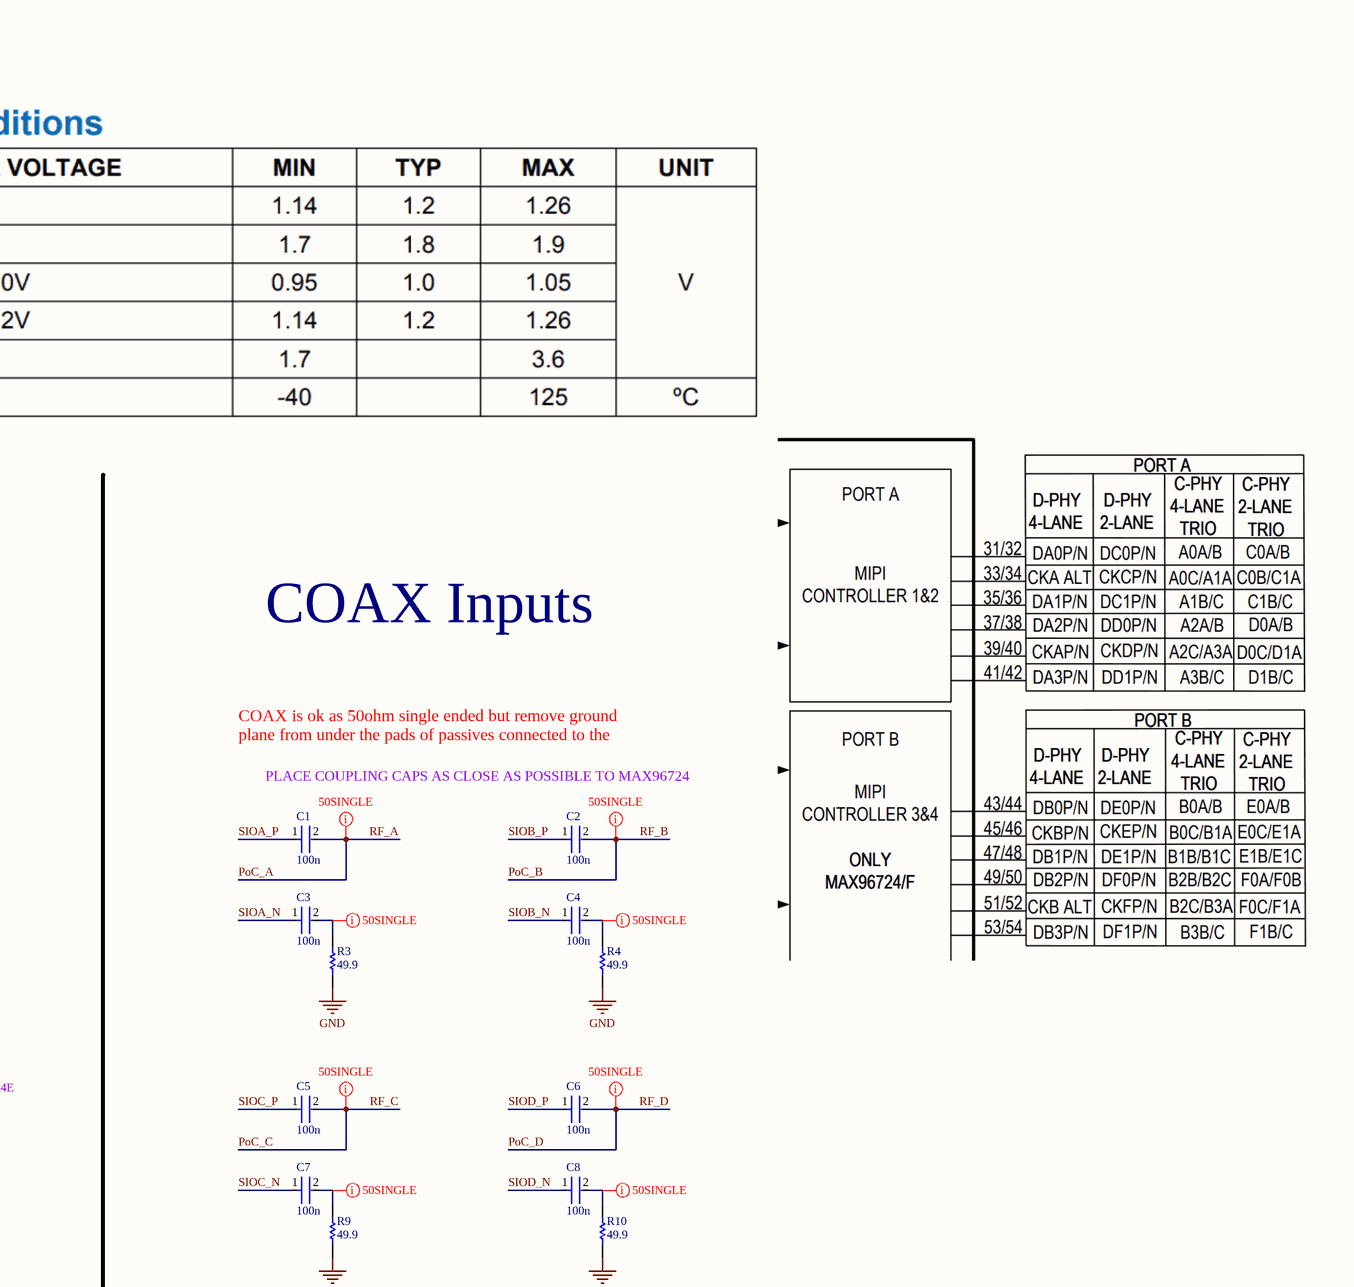
[diagram p3: GMSL_DESERIALIZER.SchDoc, top right]
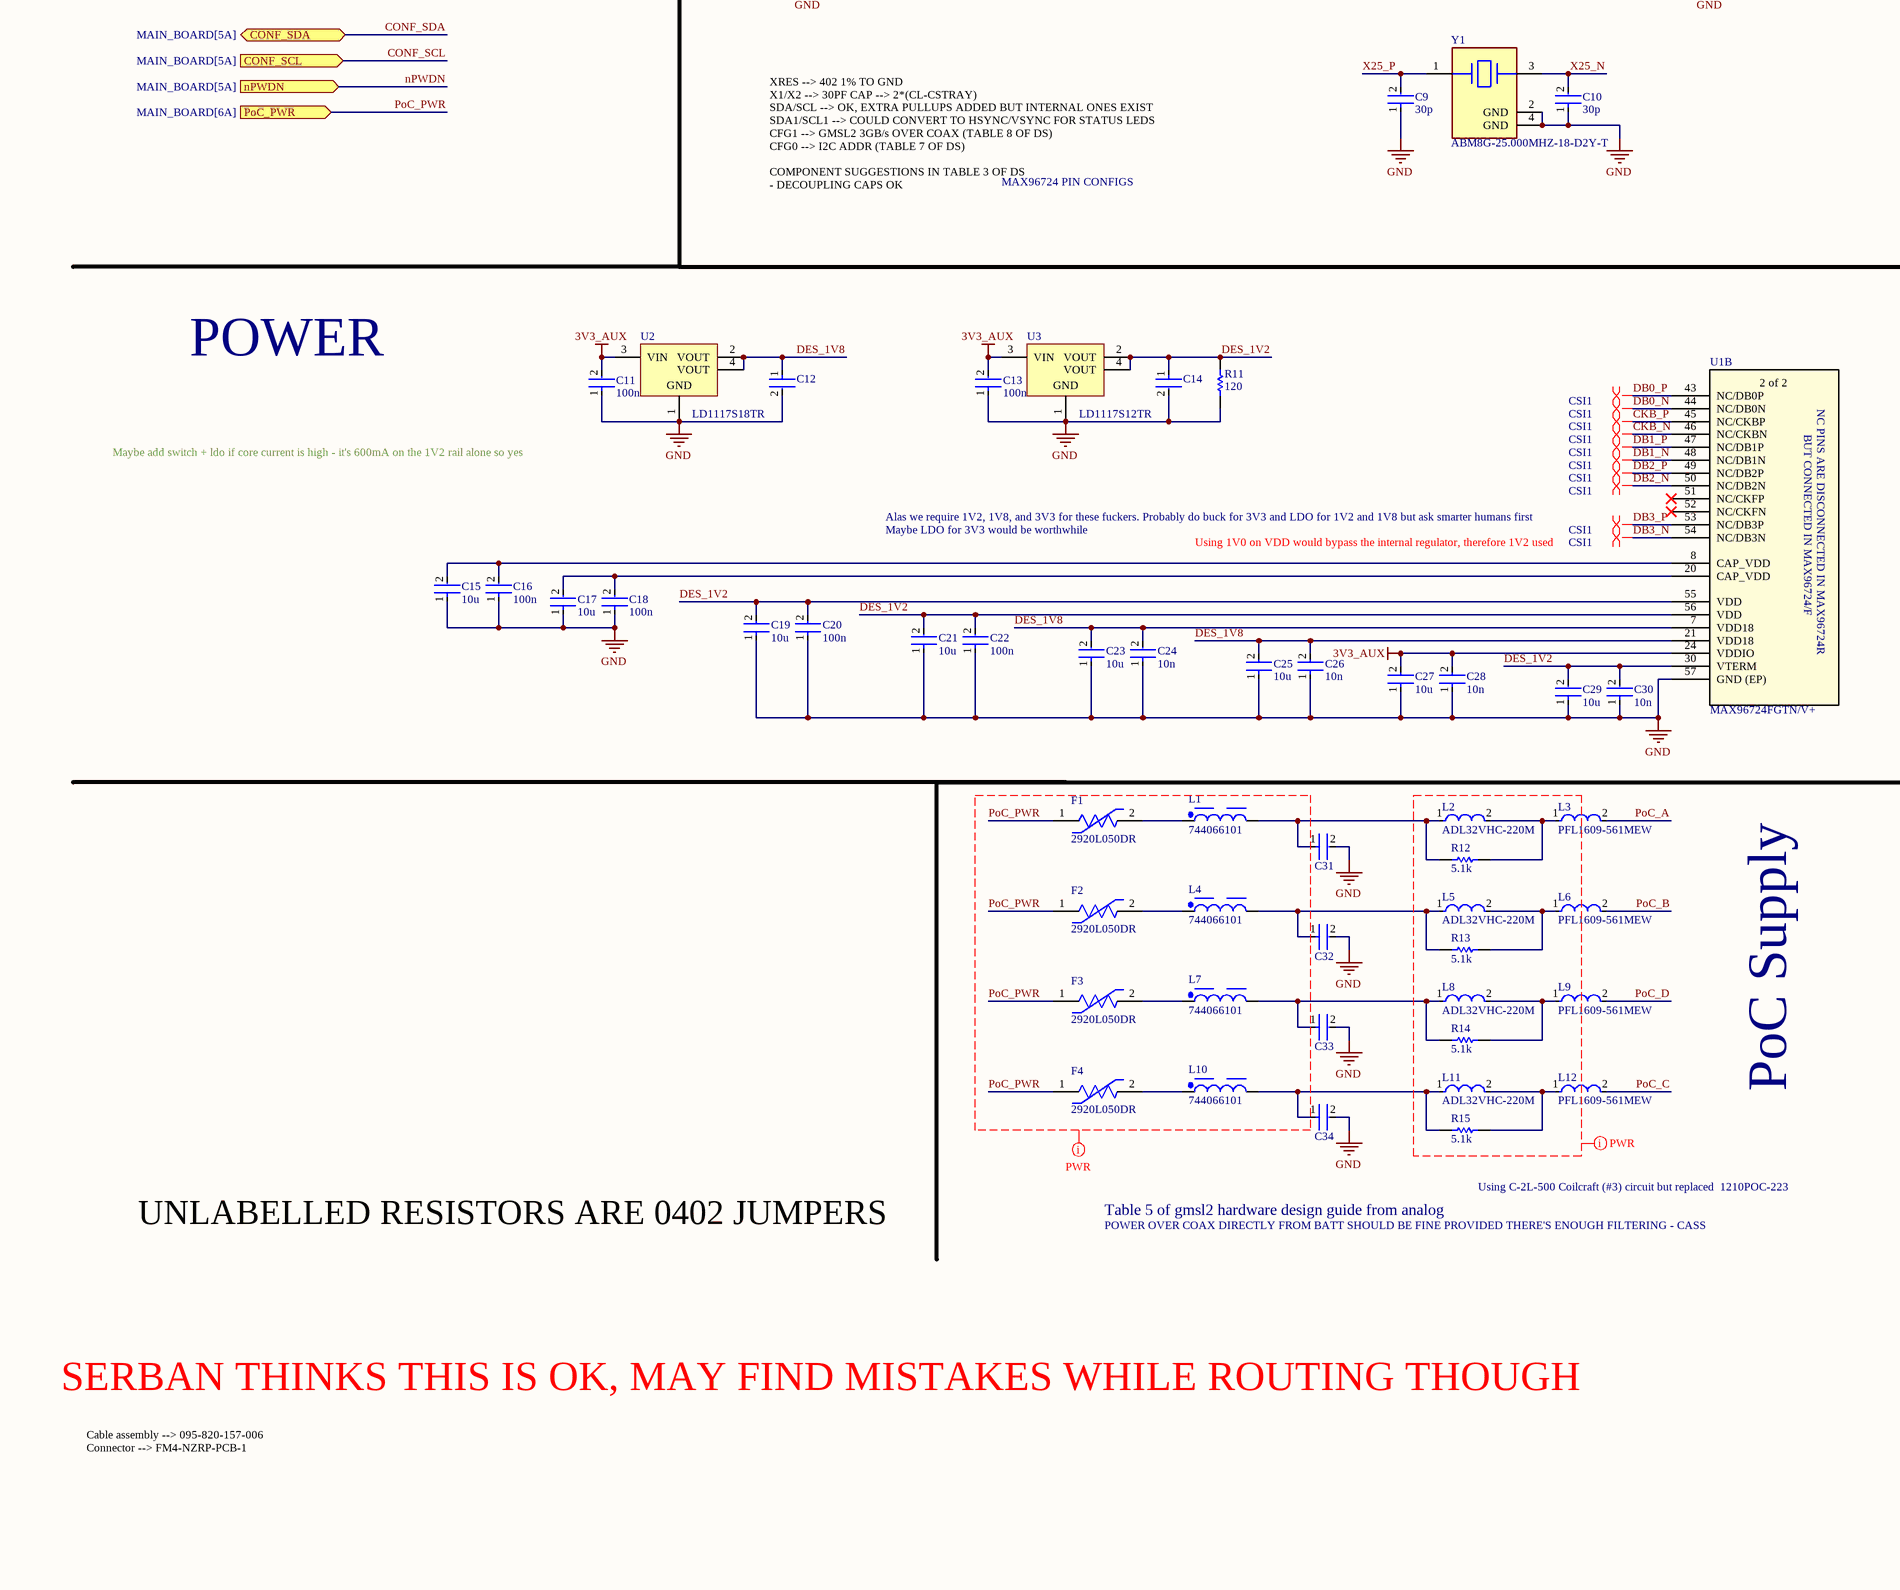
[diagram p4: GMSL_DESERIALIZER.SchDoc, bottom left]
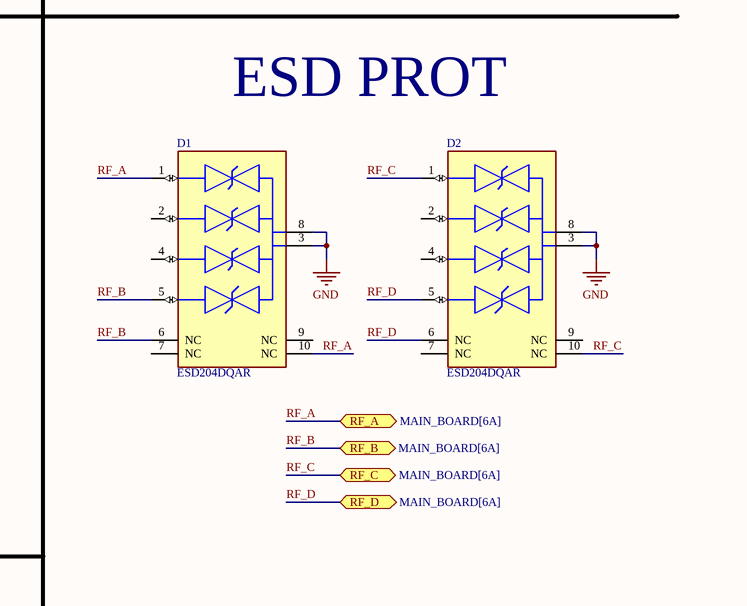
[diagram p5: GMSL_DESERIALIZER.SchDoc, bottom right]

### Parts
C1  100n  [FP-0402-L_1_0_0_05-W_0_5-IPC_A]
C2  100n  [FP-0402-L_1_0_0_05-W_0_5-IPC_A]
C3  100n  [FP-0402-L_1_0_0_05-W_0_5-IPC_A]
C4  100n  [FP-0402-L_1_0_0_05-W_0_5-IPC_A]
C5  100n  [FP-0402-L_1_0_0_05-W_0_5-IPC_A]
C6  100n  [FP-0402-L_1_0_0_05-W_0_5-IPC_A]
C7  100n  [FP-0402-L_1_0_0_05-W_0_5-IPC_A]
C8  100n  [FP-0402-L_1_0_0_05-W_0_5-IPC_A]
C9  30p  [FP-0402-L_1_0_0_05-W_0_5-IPC_A]
C10  30p  [FP-0402-L_1_0_0_05-W_0_5-IPC_A]
C11  100n  [FP-0402-L_1_0_0_05-W_0_5-IPC_A]
C12  GRM188R60J106ME47D  [FP-GRM188-0_1-e0_2_0_55-IPC_A]  (value not drawn)
C13  100n  [FP-0402-L_1_0_0_05-W_0_5-IPC_A]
C14  GRM188R60J106ME47D  [FP-GRM188-0_1-e0_2_0_55-IPC_A]  (value not drawn)
C15  10u  [FP-0402-L_1_0_0_05-W_0_5-IPC_A]
C16  100n  [FP-0402-L_1_0_0_05-W_0_5-IPC_A]
C17  10u  [FP-0402-L_1_0_0_05-W_0_5-IPC_A]
C18  100n  [FP-0402-L_1_0_0_05-W_0_5-IPC_A]
C19  10u  [FP-0402-L_1_0_0_05-W_0_5-IPC_A]
C20  100n  [FP-0402-L_1_0_0_05-W_0_5-IPC_A]
C21  10u  [FP-0402-L_1_0_0_05-W_0_5-IPC_A]
C22  100n  [FP-0402-L_1_0_0_05-W_0_5-IPC_A]
C23  10u  [FP-0402-L_1_0_0_05-W_0_5-IPC_A]
C24  10n  [FP-0402-L_1_0_0_05-W_0_5-IPC_A]
C25  10u  [FP-0402-L_1_0_0_05-W_0_5-IPC_A]
C26  10n  [FP-0402-L_1_0_0_05-W_0_5-IPC_A]
C27  10u  [FP-0402-L_1_0_0_05-W_0_5-IPC_A]
C28  10n  [FP-0402-L_1_0_0_05-W_0_5-IPC_A]
C29  10u  [FP-0402-L_1_0_0_05-W_0_5-IPC_A]
C30  10n  [FP-0402-L_1_0_0_05-W_0_5-IPC_A]
C31  GRM21BR61E226ME44L  [FP-GRM21B-0_2-e0_2_0_7-IPC_B]  (value not drawn)
C32  GRM21BR61E226ME44L  [FP-GRM21B-0_2-e0_2_0_7-IPC_B]  (value not drawn)
C33  GRM21BR61E226ME44L  [FP-GRM21B-0_2-e0_2_0_7-IPC_B]  (value not drawn)
C34  GRM21BR61E226ME44L  [FP-GRM21B-0_2-e0_2_0_7-IPC_B]  (value not drawn)
D1  ESD204DQAR  [FP-DQA0010A-MFG]
D2  ESD204DQAR  [FP-DQA0010A-MFG]
F1  2920L050DR  [FP-2920L050DR-MFG]
F2  2920L050DR  [FP-2920L050DR-MFG]
F3  2920L050DR  [FP-2920L050DR-MFG]
F4  2920L050DR  [FP-2920L050DR-MFG]
L1  744066101  [WE-TPC_1038]
L2  ADL32VHC-220M  [FP-1210POC-MFG]
L3  PFL1609-561MEW  [FP-PFL1609-MFG]
L4  744066101  [WE-TPC_1038]
L5  ADL32VHC-220M  [FP-1210POC-MFG]
L6  PFL1609-561MEW  [FP-PFL1609-MFG]
L7  744066101  [WE-TPC_1038]
L8  ADL32VHC-220M  [FP-1210POC-MFG]
L9  PFL1609-561MEW  [FP-PFL1609-MFG]
L10  744066101  [WE-TPC_1038]
L11  ADL32VHC-220M  [FP-1210POC-MFG]
L12  PFL1609-561MEW  [FP-PFL1609-MFG]
R1  402  [R0603B]
R2  10k  [R0603B]
R3  49.9  [R0603B]
R4  49.9  [R0603B]
R5  DNP  [R0603B]
R6  DNP  [R0603B]
R7  10k  [R0603B]
R8  10k  [R0603B]
R9  49.9  [R0603B]
R10  49.9  [R0603B]
R11  120  [R0603B]
R12  5.1k  [R0603B]
R13  5.1k  [R0603B]
R14  5.1k  [R0603B]
R15  5.1k  [R0603B]
U1  MAX96724FGTN/V+  [MAX96724FGTN_V+-Footprint-1]  (parts A,B of 2)
U2  LD1117S18TR  [SOT-223_M]
U3  LD1117S12TR  [SOT-223_M]
Y1  ABM8G-25.000MHZ-18-D2Y-T  [FP-ABM8G-MFG]

### Ports
CONF_SCL (in, see MAIN_BOARD[5A]), CONF_SDA (bidir, see MAIN_BOARD[5A]), CSI0_CK_N (in, see MAIN_BOARD[5A]), CSI0_CK_P (in, see MAIN_BOARD[5A]), CSI0_D0_N (bidir, see MAIN_BOARD[5A]), CSI0_D0_P (bidir, see MAIN_BOARD[5A]), CSI0_D1_N (bidir, see MAIN_BOARD[5A]), CSI0_D1_P (bidir, see MAIN_BOARD[5A]), CSI0_D2_N (bidir, see MAIN_BOARD[5A]), CSI0_D2_P (bidir, see MAIN_BOARD[5A]), CSI0_D3_N (bidir, see MAIN_BOARD[5A]), CSI0_D3_P (bidir, see MAIN_BOARD[5A]), CSI1_CK_N (in, see MAIN_BOARD[6A]), CSI1_CK_P (in, see MAIN_BOARD[6A]), CSI1_D0_N (bidir, see MAIN_BOARD[6A]), CSI1_D0_P (bidir, see MAIN_BOARD[6A]), CSI1_D1_N (bidir, see MAIN_BOARD[6A]), CSI1_D1_P (bidir, see MAIN_BOARD[6A]), CSI1_D2_N (bidir, see MAIN_BOARD[6A]), CSI1_D2_P (bidir, see MAIN_BOARD[6A]), CSI1_D3_N (bidir, see MAIN_BOARD[6A]), CSI1_D3_P (bidir, see MAIN_BOARD[6A]), nPWDN (in, see MAIN_BOARD[5A]), PoC_PWR (in, see MAIN_BOARD[6A]), RF_A (bidir, see MAIN_BOARD[6A]), RF_B (bidir, see MAIN_BOARD[6A]), RF_C (bidir, see MAIN_BOARD[6A]), RF_D (bidir, see MAIN_BOARD[6A])

### Nets
3V3_AUX: C11.2 C13.2 C27.2 C28.2 R2.2 R5.2 R6.2 U1.24(VDDIO) U2.3(VIN) U3.3(VIN)
GND: C9.1 C10.1 C11.1 C12.2 C13.1 C14.2 C15.1 C16.1 C17.1 C18.1 C19.1 C20.1 C21.1 C22.1 C23.1 C24.1 C25.1 C26.1 C27.1 C28.1 C29.1 C30.1 C31.2 C32.2 C33.2 C34.2 D1.3(GND) D1.8(GND) D2.3(GND) D2.8(GND) R1.1 R3.1 R4.1 R7.1 R8.1 R9.1 R10.1 R11.1 U1.57(GND_(EP)) U2.1(GND) U3.1(GND) Y1.2(GND) Y1.4(GND)
CFG0: R6.1 R8.2 U1.4(CFG0)
CKA_N: U1.40(CKAN)
CKA_P: U1.39(CKAP)
CKB_N: U1.46(NC/CKBN) ; port CSI1_CK_N
CKB_P: U1.45(NC/CKBP) ; port CSI1_CK_P
CKC_N: port CSI0_CK_N
CKC_P: port CSI0_CK_P
CONF_SCL: U1.29(SCL) ; port CONF_SCL
CONF_SDA: U1.28(SDA) ; port CONF_SDA
DA0_N: U1.32(DA0N) ; port CSI0_D0_N
DA0_P: U1.31(DA0P) ; port CSI0_D0_P
DA1_N: U1.36(DA1N) ; port CSI0_D1_N
DA1_P: U1.35(DA1P) ; port CSI0_D1_P
DA2_N: U1.38(DA2N) ; port CSI0_D2_N
DA2_P: U1.37(DA2P) ; port CSI0_D2_P
DA3_N: U1.42(DA3N) ; port CSI0_D3_N
DA3_P: U1.41(DA3P) ; port CSI0_D3_P
DB0_N: U1.44(NC/DB0N) ; port CSI1_D0_N
DB0_P: U1.43(NC/DB0P) ; port CSI1_D0_P
DB1_N: U1.48(NC/DB1N) ; port CSI1_D1_N
DB1_P: U1.47(NC/DB1P) ; port CSI1_D1_P
DB2_N: U1.50(NC/DB2N) ; port CSI1_D2_N
DB2_P: U1.49(NC/DB2P) ; port CSI1_D2_P
DB3_N: U1.54(NC/DB3N) ; port CSI1_D3_N
DB3_P: U1.53(NC/DB3P) ; port CSI1_D3_P
DES_1V2: C14.1 C19.2 C20.2 C21.2 C22.2 C29.2 C30.2 R11.2 U1.30(VTERM) U1.55(VDD) U1.56(VDD) U3.2(VOUT) U3.4(VOUT)
DES_1V8: C12.1 C23.2 C24.2 C25.2 C26.2 U1.7(VDD18) U1.21(VDD18) U2.2(VOUT) U2.4(VOUT)
MFP6: R5.1 R7.2 U1.25(CFG1/MFP6)
nERRB: U1.14(MFP5)
nLOCK: U1.13(MFP4)
nPWDN: R2.1 U1.11(PWDNB) ; port nPWDN
PoC_A: C1.2 D1.1(IO1) D1.10(NC) L3.2 ; port RF_A  [also labelled RF_A]
PoC_B: C2.2 D1.5(IO4) D1.6(NC) L6.2 ; port RF_B  [also labelled RF_B]
PoC_C: C5.2 D2.1(IO1) D2.10(NC) L12.2 ; port RF_C  [also labelled RF_C]
PoC_D: C6.2 D2.5(IO4) D2.6(NC) L9.2 ; port RF_D  [also labelled RF_D]
PoC_PWR: F1.1 F2.1 F3.1 F4.1 ; port PoC_PWR
SIOA_N: C3.1 U1.22(SIOAN)
SIOA_P: C1.1 U1.23(SIOAP)
SIOB_N: C4.1 U1.19(SIOBN)
SIOB_P: C2.1 U1.18(SIOBP)
SIOC_N: C7.1 U1.9(SIOCN)
SIOC_P: C5.1 U1.10(SIOCP)
SIOD_N: C8.1 U1.6(SIODN)
SIOD_P: C6.1 U1.5(SIODP)
X25_N: C10.2 U1.16(X2) Y1.3
X25_P: C9.2 U1.15(X1/OSC) Y1.1
NetC3_2: C3.2 R3.2
NetC4_2: C4.2 R4.2
NetC7_2: C7.2 R9.2
NetC8_2: C8.2 R10.2
NetC15_2: C15.2 C16.2 U1.8(CAP_VDD)
NetC17_2: C17.2 C18.2 U1.20(CAP_VDD)
NetC31_1: C31.1 L1.2 L2.1 R12.2
NetC32_1: C32.1 L4.2 L5.1 R13.2
NetC33_1: C33.1 L7.2 L8.1 R14.2
NetC34_1: C34.1 L10.2 L11.1 R15.2
NetF1_2: F1.2 L1.1
NetF2_2: F2.2 L4.1
NetF3_2: F3.2 L7.1
NetF4_2: F4.2 L10.1
NetL2_2: L2.2 L3.1 R12.1
NetL5_2: L5.2 L6.1 R13.1
NetL8_2: L8.2 L9.1 R14.1
NetL11_2: L11.2 L12.1 R15.1
NetR1_2: R1.2 U1.17(XRES)

Not connected (* = marked no-connect by the designer): D1 2(IO2) 4(IO3) 7(NC) 9(NC); D2 2(IO2) 4(IO3) 7(NC) 9(NC); U1 1(MFP0)* 2(MFP1)* 3(MFP2)* 12(MFP3)* 26(SDA1/MFP7)* 27(SCL1/MFP8)* 33(CKCP)* 34(CKCN)* 51(NC/CKFP)* 52(NC/CKFN)*

### Layout directives
differential pair; differential pair class CSI0: CKA_N, CKA_P, DA0_N, DA0_P, DA1_N, DA1_P, DA2_N, DA2_P, DA3_N, DA3_P
differential pair; differential pair class 100DIFF: SIOA_N, SIOA_P, SIOB_N, SIOB_P, SIOC_N, SIOC_P, SIOD_N, SIOD_P
differential pair: X25_N, X25_P
differential pair; differential pair class CSI1: CKB_N, CKB_P, DB0_N, DB0_P, DB1_N, DB1_P, DB2_N, DB2_P, DB3_N, DB3_P
net class PWR: (no net found under the mark), PoC_PWR
differential pair; differential pair class CSI0_PRE: CKC_N, CKC_P, DA0_N, DA0_P, DA1_N, DA1_P, DA2_N, DA2_P, DA3_N, DA3_P
differential pair; differential pair class CSI1_PRE: CKB_N, CKB_P, DB0_N, DB0_P, DB1_N, DB1_P, DB2_N, DB2_P, DB3_N, DB3_P
net class 50SINGLE: NetC3_2, NetC4_2, NetC7_2, NetC8_2, PoC_A, PoC_B, PoC_C, PoC_D

### Notes on the sheet
- CSI + I2C + PoC IN
- GMSL Aggregator
- COAX Inputs
- COAX is ok as 50ohm single ended but remove ground plane from under the pads of passives connected to the GMSL trace
- PLACE COUPLING CAPS AS CLOSE AS POSSIBLE TO MAX96724
- (near R2) CSI WIRING AS PER PAGE 23 OF MAX96724 DS
- Line fault?
- prob no since poc>>
- CAN ALSO JUST 10K PD
- NO COUPLING CAPS HERE SINCE THIS IS THE TRANSMITTING END
- GMSL2 3GB/s mode
- COAX +
- Table 7 and 8 of DS for CFG configs
- MAX96724FGTN/V+ is option with dual CSI out
- (near R8) I2C ADDR 0x5C
- (near R8) REMOVE PULLUP FOR 0x4E
- XRES --> 402 1% TO GND
  X1/X2 --> 30PF CAP --> 2*(CL-CSTRAY)
  SDA/SCL --> OK, EXTRA PULLUPS ADDED BUT INTERNAL ONES EXIST
  SDA1/SCL1 --> COULD CONVERT TO HSYNC/VSYNC FOR STATUS LEDS
  CFG1 --> GMSL2 3GB/s OVER COAX (TABLE 8 OF DS)
  CFG0 --> I2C ADDR (TABLE 7 OF DS)
  COMPONENT SUGGESTIONS IN TABLE 3 OF DS
  - DECOUPLING CAPS OK
- MAX96724 PIN CONFIGS
- ESD PROT
- POWER
- Maybe add switch + ldo if core current is high - it's 600mA on the 1V2 rail alone so yes
- Alas we require 1V2, 1V8, and 3V3 for these fuckers. Probably do buck for 3V3 and LDO for 1V2 and 1V8 but ask smarter humans first
- Maybe LDO for 3V3 would be worthwhile
- Using 1V0 on VDD would bypass the internal regulator, therefore 1V2 used
- PoC Supply
- Using C-2L-500 Coilcraft (#3) circuit but replaced  1210POC-223
- UNLABELLED RESISTORS ARE 0402 JUMPERS
- Table 5 of gmsl2 hardware design guide from analog
- POWER OVER COAX DIRECTLY FROM BATT SHOULD BE FINE PROVIDED THERE'S ENOUGH FILTERING - CASS
- SERBAN THINKS THIS IS OK, MAY FIND MISTAKES WHILE ROUTING THOUGH
- Cable assembly --> 095-820-157-006
  Connector --> FM4-NZRP-PCB-1
- (in symbol CMP-015-00011-2, part A) 1 of 2
- (in symbol CMP-015-00011-2, part B) 2 of 2; NC PINS ARE DISCONNECTED IN MAX96724R; BUT CONNECTED IN MAX96724/F

### Library data of the parts
C1-C11 C13 C15-C30 = CMP-001-00058-1: LARGE PADS, 0402 CAP, CHANGE COMMENT TO MATCH REAL P/N; Capacitor Type: Ceramic; Min Operating Temperature: -55°C; Mounting Technology: Surface Mount; Pins: 2; Case/Package: 0402; RoHS Compliant: Yes; Max Operating Temperature: 85°C
C12 C14 = CMP-2006-02792-2: as C?#15 on sheet HDMI; Packaging: Tape and Reel; Voltage Rating (DC): 6.3V; Width: 0.031inch; Termination: SMD/SMT; Dielectric: X5R; Package Quantity: 4000; Voltage Rating: 6.3V; Capacitance: 10uF; Case/Package: 0603; Min Operating Temperature: -55°C; Voltage: 6.3V; Length: 1.6mm; Thickness: 0.035inch; Lead Free: Lead Free; Depth: 0.8mm; Case Code (Imperial): 0603; Max Operating Temperature: 85°C; Material: Ceramic; Height: 0.8mm; Tolerance: 20%; Mount: Surface Mount; REACH SVHC: No SVHC; Radiation Hardening: No; Case Code (Metric): 1608
C31-C34 = CMP-2007-03222-3: Chip Multilayer Ceramic Capacitors for General Purpose, 0805, 22uF, X5R, 15%, 20%, 25V; Case/Package: 0805; Depth: 1.25mm; Resistor Type: Ceramic; Voltage Rating: 25V; Lead Free: Lead Free; Voltage Rating (DC): 25V; Case Code (Metric): 2012; Thickness: 0.057inch; REACH SVHC: No SVHC; Material: Ceramic; Tolerance: 20%; Length: 2mm; Capacitance: 22uF; Case Code (Imperial): 0805; Max Operating Temperature: 85°C; Termination: SMD/SMT; Weight: 0.000335oz; Dielectric: X5R; Packaging: Tape and Reel; Voltage: 25V; Package Quantity: 3000; Height: 1.25mm; Mount: Surface Mount; Width: 1.25mm; Min Operating Temperature: -55°C
D1 D2 = CMP-04989-000002-1: as D?#1 on sheet HDMI; Ambient Temperature Range High: +125°C; ComponentLink2Description: Datasheet; Height: 0.55mm; Lead Free: Yes; Device Class L3: unset; Temperature Range High: +125°C; Temperature Range Low: -40°C; Package: DQA0010A; Temperature: -40°C to +125°C; Capacitance: 0.55pF; RoHS: TRUE; Mouser Description: 4-Channel Low-Capacitance Surge and ESD Protection Diode 10-USON -40 to 125; Category: Diode; Device Class L1: Circuit Protection; Octopart: https://octopart.com/esd204dqar-texas+instruments-89917476; Device Class L2: TVS Diodes; Ambient Temperature Range Low: -40°C; Manufacturer Part Number: ESD204DQAR; ComponentLink2URL: http://www.ti.com/lit/ds/symlink/esd204.pdf; Automotive: No; Digikey Description: 4-CHANNEL LOW-CAPACITANCE SURGE
F1-F4 = CMP-08606-000071-1: PTC RESET FUSE 60V 500MA 2920; Resistance: 1.4R; Trip Current: 1A; Power Dissipation: 1.5W; Time to Trip: 4s; Approvals: cULus; Current Rating: 10A; Operating Supply Voltage: 60V; Termination: SMD/SMT; Width: 5.44mm; Case/Package: 2920; Series: 2920L; Case Code (Imperial): 2920; Height: 1.25mm; Hold Current: 500mA; Terminal Material: Copper; Min Operating Temperature: -40°C; Package Quantity: 1500; Max Voltage Rating (DC): 60V; RoHS Compliant: Yes; Case Code (Metric): 7351; Lead Free: Lead Free; Max Operating Temperature: 85°C; Voltage Rating (DC): 60V; Working Voltage: 60V; Length: 7.98mm; REACH SVHC: No SVHC; Max Current Rating: 10A; Voltage Rating: 60V; Packaging: Tape and Reel
L1 L4 L7 L10 = CMP-0227-00094-3: NexarPartId: 8917123; Current Rating: 1.2A; Shielding: Shielded; Core Material: Ferrite; Inductance: 100µH; Test Frequency: 100kHz; Tolerance: 30%; Resistance: 255mΩ; Self Resonant Frequency: 6MHz; Composition: Wirewound; Packaging: Cut Tape (CT); REACH SVHC: Unknown; Number of Pins: 2; Max DC Current: 1.2A; Saturation Current: 1.2A; Ambient Temperature Range High: 95°C; Weight: 1.273007g; Height: 3.8mm; Width: 10mm; Min Operating Temperature: -40°C; Max Operating Temperature: 125°C; Termination: SMD/SMT; Height - Seated (Max): 4.0894mm; Length: 10mm; RMS Current (Irms): 1.2A; Ambient Temperature Range Low: -40°C; RoHS: Compliant; Mount: Surface Mount; Depth: 10mm; DC Resistance (DCR): 255mΩ; Inductance Tolerance: 30%; Case/Package: Nonstandard
L2 L5 L8 L11 = CMP-11268-000041-1: NOT COILCRAFT - ACTUAL P# --> ADL32VHC-220M / - Power Injection Chokes for PoC; Manufacturer Part Number: 1210POC-223MRC; Value: 22uH; Core Material: Ferrite; Saturation Current: 720mA; Series Resistance: 0.88Ω; Rms Current: 700mA; Automotive Grade: Grade 1; Self Resonant Frequency: 70MHz; Test Frequency: 100kHz; Tolerance: 20%; Ambient Temperature Range High: +125°C; Manufacturer: coilcraft; Octopart: https://octopart.com/1210poc-223mrc-coilcraft-103207315; Category: Ind; Device Class L2: Inductors; RoHS: TRUE; Device Class L3: Fixed Inductors; Package: 1210POC; Ambient Temperature Range Low: -40°C; ComponentLink2URL: https://drive.google.com/open?id=15FlOq8Y4YbRFohfA_cJ40jgnqs8va2Mh; Lead Free: Yes; Inductance: 22uH; Device Class L1: Passive Components; ComponentLink2Description: Datasheet; Automotive: Yes; Height: 3mm
L3 L6 L9 L12 = CMP-11268-000007-1: Fixed Inductors PFL1609 Low Profile 0.56 uH 20 % 1.4 A; Manufacturer: coilcraft; Rms Current: 1100mA; Self Resonant Frequency: 600MHz; Core Material: Composite; Tolerance: 20%; Value: 0.56uH; Automotive Grade: Grade 1; Saturation Current: 710mA; Test Frequency: 7.9MHz; Shielding: true; Series Resistance: 130mΩ; Lead Free: Yes; Device Class L1: Passive Components; Package: PFL1609; Octopart: https://octopart.com/pfl1609-561mew-coilcraft-20329171; ComponentLink2URL: https://www.coilcraft.com/pdfs/pfl1609.pdf; Manufacturer Part Number: PFL1609-561MEW; Ambient Temperature Range Low: -40°C; Composition: Wirewound; Inductance: 0.56uH; Device Class L2: Inductors; Category: Ind; Device Class L3: Fixed Inductors; Mouser Description: Fixed Inductors PFL1609 Low Profile 0.56 uH 20 % 1.4 A; Automotive: Yes; ComponentLink2Description: Datasheet; Ambient Temperature Range High: +105°C; Height: 0.95mm; RoHS: TRUE
R1-R15 = CMP-009-00002-14: Resistor
U1 = CMP-015-00011-2: Quad Tunneling GMSL2/1 to CSI-2 Deserializer
U2 = CMP-0244-00308-1: Fixed Low Drop Positive Voltage Regulator, 1.8V, 4-Pin SOT-223, Tape and Reel; ComponentLink1URL: http://www.st.com; PackageReference: SOT-223; PackageDescription: 4-Pin SOT-223 Package, 6.5 x 3.5 mm Body, 2.3 mm Pitch, 7 mm Lead Span; ComponentLink2URL: http://www.st.com/internet/com/TECHNICAL_RESOURCES/TECHNICAL_LITERATURE/DATASHEET/CD00000544.pdf; ComponentLink2Description: Datasheet; ComponentLink1Description: Manufacturer URL; DatasheetVersion: 1/11/2011; PackageVersion: 2010
U3 = CMP-0244-00318-1: Fixed Low Drop Positive Voltage Regulator, 1.2V, 4-Pin SOT-223, Tape and Reel; PackageDescription: 4-Pin SOT-223 Package, 6.5 x 3.5 mm Body, 2.3 mm Pitch, 7 mm Lead Span; PackageVersion: 2010; ComponentLink2Description: Datasheet; PackageReference: SOT-223; ComponentLink2URL: http://www.st.com/internet/com/TECHNICAL_RESOURCES/TECHNICAL_LITERATURE/DATASHEET/CD00000544.pdf; ComponentLink1Description: Manufacturer URL; DatasheetVersion: 1/11/2011; ComponentLink1URL: http://www.st.com
Y1 = CMP-2000-05733-3: Crystal 25MHz ±20ppm (Tol) ±30ppm (Stability) 18pF FUND 60Ω 4-Pin SMD T/R; Series Resistance: 60R; Length: 3.2mm; Depth: 2.5mm; Packaging: Tape and Reel; Min Operating Temperature: -40°C; Operating Frequency: 25 MHz; Lead Free: Lead Free; Number of Pins: 4; Frequency Tolerance: 20ppm; Radiation Hardening: No; Max Operating Temperature: 85°C; Termination: SMD/SMT; Frequency Stability: 30ppm; Frequency: 25MHz; Series: ABM8G; Mount: Surface Mount; Package Quantity: 1000; Height: 0.039inch; Width: 0.098inch; Case/Package: CSMD; ESR (Equivalent Series Resistance): 60R; Load Capacitance: 18pF; Tolerance: 20ppm

## Sheet GMSL_SERIALIZER.SchDoc
size C; SheetNumber: 7; SheetTotal: 10
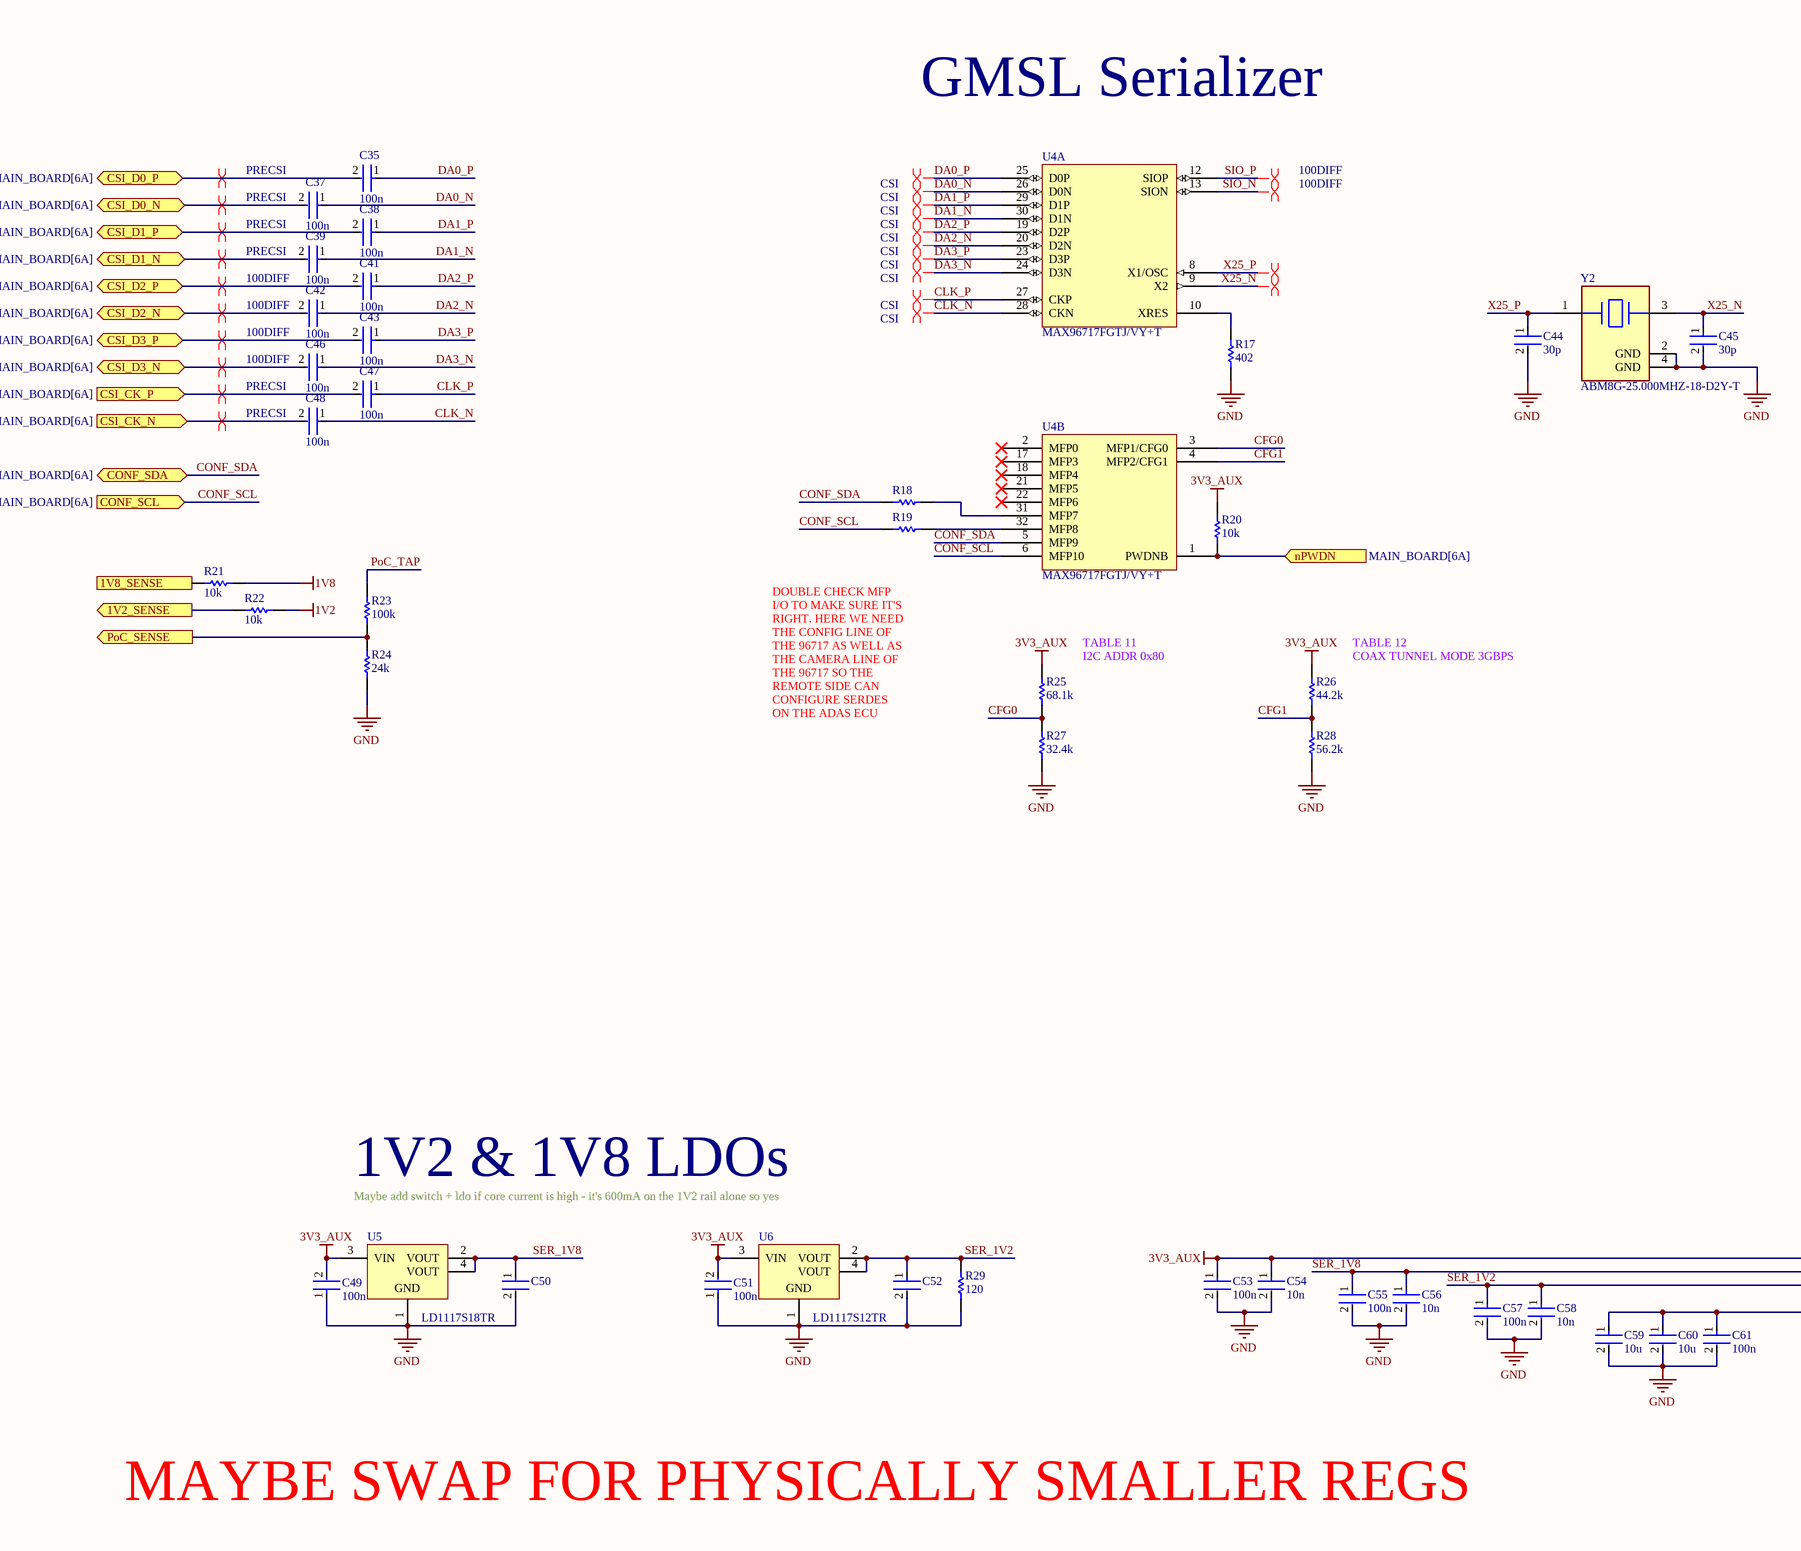
[diagram p6: GMSL_SERIALIZER.SchDoc, left]
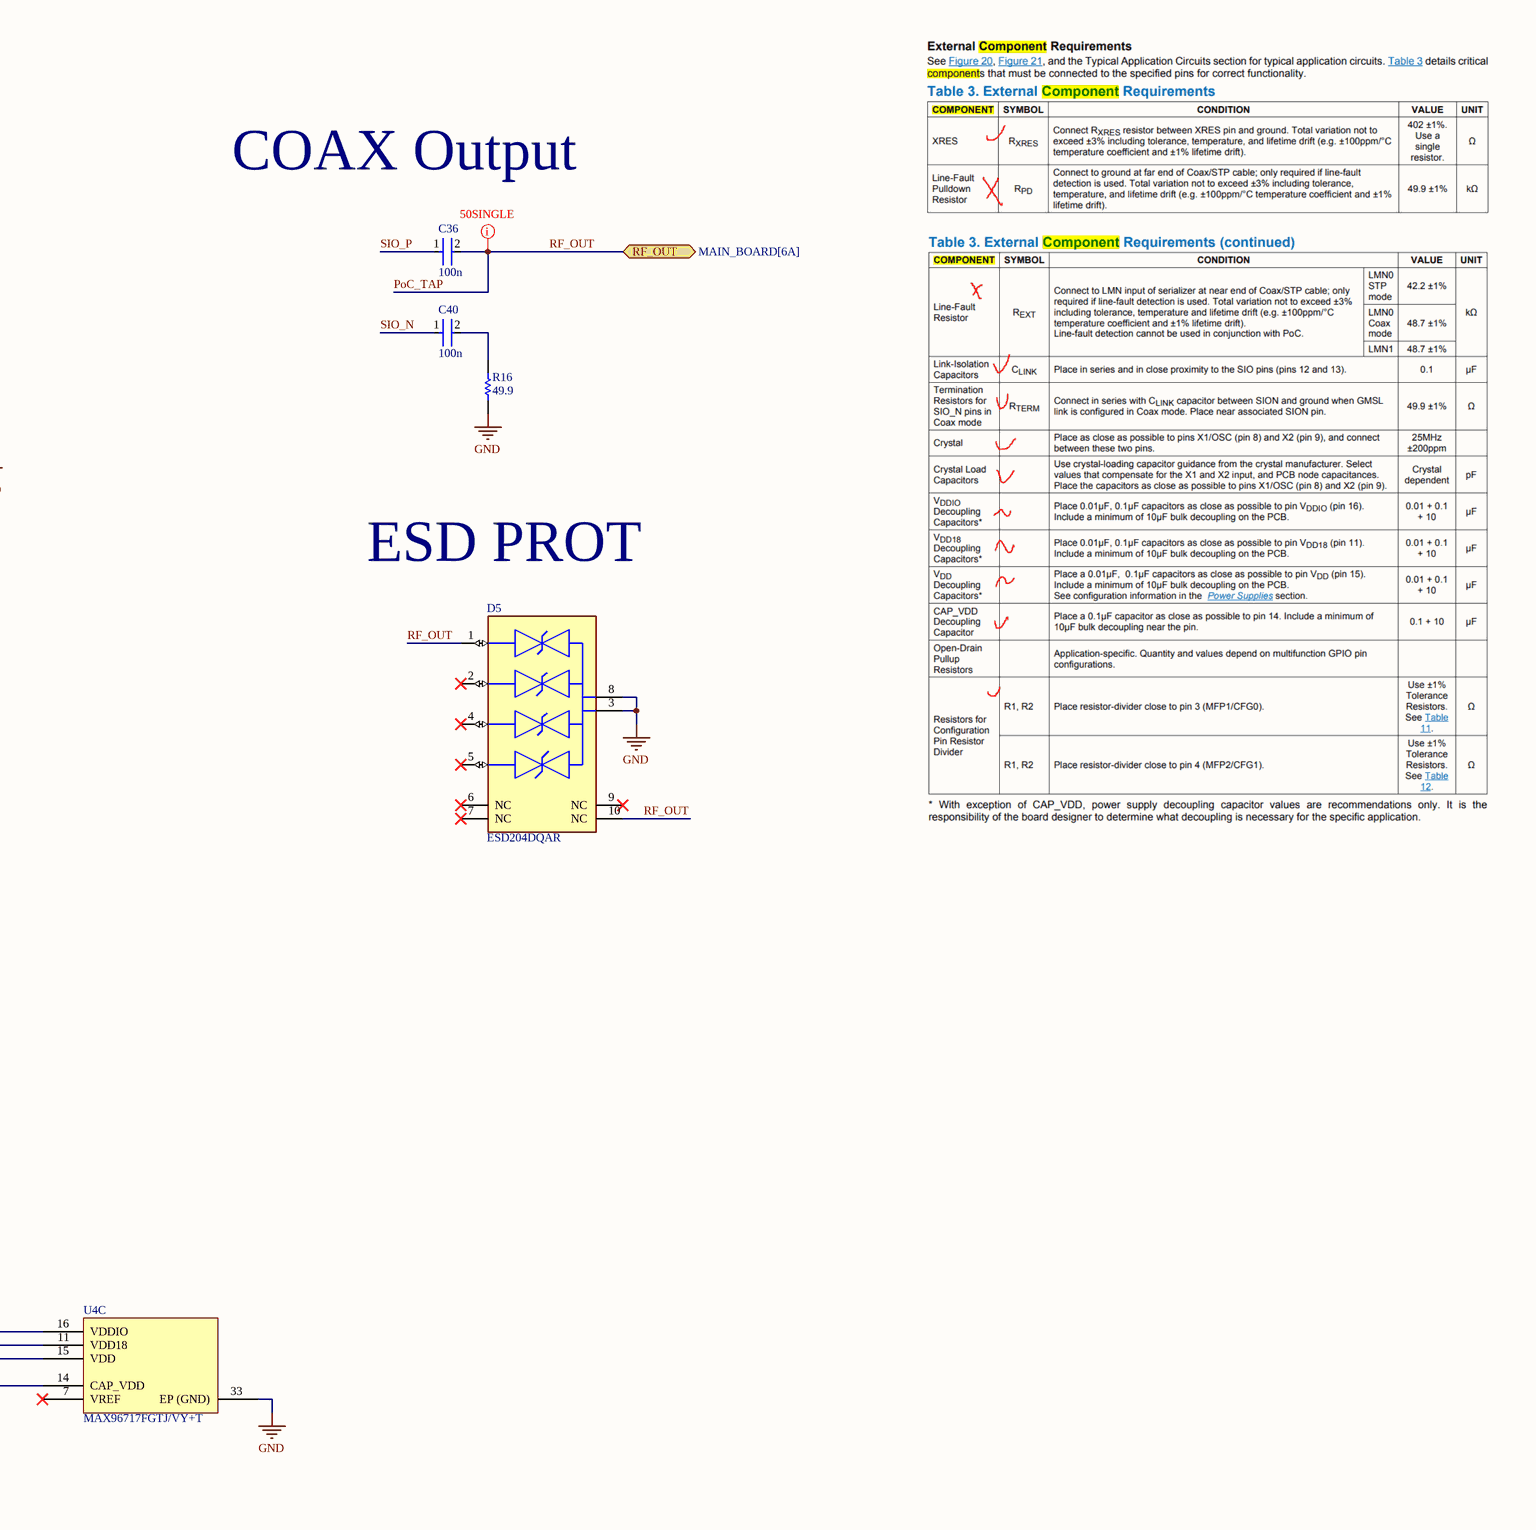
[diagram p7: GMSL_SERIALIZER.SchDoc, right]

### Parts
C35  100n  [FP-0402-L_1_0_0_05-W_0_5-IPC_A]
C36  100n  [FP-0402-L_1_0_0_05-W_0_5-IPC_A]
C37  100n  [FP-0402-L_1_0_0_05-W_0_5-IPC_A]
C38  100n  [FP-0402-L_1_0_0_05-W_0_5-IPC_A]
C39  100n  [FP-0402-L_1_0_0_05-W_0_5-IPC_A]
C40  100n  [FP-0402-L_1_0_0_05-W_0_5-IPC_A]
C41  100n  [FP-0402-L_1_0_0_05-W_0_5-IPC_A]
C42  100n  [FP-0402-L_1_0_0_05-W_0_5-IPC_A]
C43  100n  [FP-0402-L_1_0_0_05-W_0_5-IPC_A]
C44  30p  [FP-0402-L_1_0_0_05-W_0_5-IPC_A]
C45  30p  [FP-0402-L_1_0_0_05-W_0_5-IPC_A]
C46  100n  [FP-0402-L_1_0_0_05-W_0_5-IPC_A]
C47  100n  [FP-0402-L_1_0_0_05-W_0_5-IPC_A]
C48  100n  [FP-0402-L_1_0_0_05-W_0_5-IPC_A]
C49  100n  [FP-0402-L_1_0_0_05-W_0_5-IPC_A]
C50  GRM188R60J106ME47D  [FP-GRM188-0_1-e0_2_0_55-IPC_A]  (value not drawn)
C51  100n  [FP-0402-L_1_0_0_05-W_0_5-IPC_A]
C52  GRM188R60J106ME47D  [FP-GRM188-0_1-e0_2_0_55-IPC_A]  (value not drawn)
C53  100n  [FP-0402-L_1_0_0_05-W_0_5-IPC_A]
C54  10n  [FP-0402-L_1_0_0_05-W_0_5-IPC_A]
C55  100n  [FP-0402-L_1_0_0_05-W_0_5-IPC_A]
C56  10n  [FP-0402-L_1_0_0_05-W_0_5-IPC_A]
C57  100n  [FP-0402-L_1_0_0_05-W_0_5-IPC_A]
C58  10n  [FP-0402-L_1_0_0_05-W_0_5-IPC_A]
C59  10u  [FP-0402-L_1_0_0_05-W_0_5-IPC_A]
C60  10u  [FP-0402-L_1_0_0_05-W_0_5-IPC_A]
C61  100n  [FP-0402-L_1_0_0_05-W_0_5-IPC_A]
D5  ESD204DQAR  [FP-DQA0010A-MFG]
R16  49.9  [R0603B]
R17  402  [R0603B]
R18  0402 JUMPER  [RESC1005X40X25ML05T05]  (value not drawn)
R19  0402 JUMPER  [RESC1005X40X25ML05T05]  (value not drawn)
R20  10k  [R0603B]
R21  10k  [R0603B]
R22  10k  [R0603B]
R23  100k  [R0603B]
R24  24k  [R0603B]
R25  68.1k  [R0603B]
R26  44.2k  [R0603B]
R27  32.4k  [R0603B]
R28  56.2k  [R0603B]
R29  120  [R0603B]
U4  MAX96717FGTJ/VY+T  [QFN50P500X500X80_HS-33N]  (parts A,B,C of 3)
U5  LD1117S18TR  [SOT-223_M]
U6  LD1117S12TR  [SOT-223_M]
Y2  ABM8G-25.000MHZ-18-D2Y-T  [FP-ABM8G-MFG]

### Ports
1V2_SENSE (out), 1V8_SENSE (out), CONF_SCL (in, see MAIN_BOARD[6A]), CONF_SDA (bidir, see MAIN_BOARD[6A]), CSI_CK_N (in, see MAIN_BOARD[6A]), CSI_CK_P (in, see MAIN_BOARD[6A]), CSI_D0_N (bidir, see MAIN_BOARD[6A]), CSI_D0_P (bidir, see MAIN_BOARD[6A]), CSI_D1_N (bidir, see MAIN_BOARD[6A]), CSI_D1_P (bidir, see MAIN_BOARD[6A]), CSI_D2_N (bidir, see MAIN_BOARD[6A]), CSI_D2_P (bidir, see MAIN_BOARD[6A]), CSI_D3_N (bidir, see MAIN_BOARD[6A]), CSI_D3_P (bidir, see MAIN_BOARD[6A]), nPWDN (in, see MAIN_BOARD[6A]), PoC_SENSE (out), RF_OUT (bidir, see MAIN_BOARD[6A])

### Nets
1V2: R22.1
1V8: R21.1
3V3_AUX: C49.2 C51.2 C53.1 C54.1 R20.2 R25.2 R26.2 U4.16(VDDIO) U5.3(VIN) U6.3(VIN)
GND: C44.2 C45.2 C49.1 C50.2 C51.1 C52.2 C53.2 C54.2 C55.2 C56.2 C57.2 C58.2 C59.2 C60.2 C61.2 D5.3(GND) D5.8(GND) R16.1 R17.1 R24.1 R27.1 R28.1 R29.1 U4.33(EP_(GND)) U5.1(GND) U6.1(GND) Y2.2(GND) Y2.4(GND)
CFG0: R25.1 R27.2 U4.3(MFP1/CFG0)
CFG1: R26.1 R28.2 U4.4(MFP2/CFG1)
CLK_N: C48.1 U4.28(CKN)
CLK_P: C47.1 U4.27(CKP)
CONF_SCL: R19.1 U4.6(MFP10) ; port CONF_SCL
CONF_SDA: R18.1 U4.5(MFP9) ; port CONF_SDA
DA0_N: C37.1 U4.26(D0N)
DA0_P: C35.1 U4.25(D0P)
DA1_N: C39.1 U4.30(D1N)
DA1_P: C38.1 U4.29(D1P)
DA2_N: C42.1 U4.20(D2N)
DA2_P: C41.1 U4.19(D2P)
DA3_N: C46.1 U4.24(D3N)
DA3_P: C43.1 U4.23(D3P)
nPWDN: R20.1 U4.1(PWDNB) ; port nPWDN
PoC_TAP: C36.2 D5.1(IO1) D5.10(NC) R23.2 ; port RF_OUT  [also labelled RF_OUT]
SER_1V2: C52.1 C57.1 C58.1 R29.2 U4.15(VDD) U6.2(VOUT) U6.4(VOUT)
SER_1V8: C50.1 C55.1 C56.1 U4.11(VDD18) U5.2(VOUT) U5.4(VOUT)
SIO_N: C40.1 U4.13(SION)
SIO_P: C36.1 U4.12(SIOP)
X25_N: C45.1 U4.9(X2) Y2.3
X25_P: C44.1 U4.8(X1/OSC) Y2.1
NetC35_2: C35.2 ; port CSI_D0_P
NetC37_2: C37.2 ; port CSI_D0_N
NetC38_2: C38.2 ; port CSI_D1_P
NetC39_2: C39.2 ; port CSI_D1_N
NetC40_2: C40.2 R16.2
NetC41_2: C41.2 ; port CSI_D2_P
NetC42_2: C42.2 ; port CSI_D2_N
NetC43_2: C43.2 ; port CSI_D3_P
NetC46_2: C46.2 ; port CSI_D3_N
NetC47_2: C47.2 ; port CSI_CK_P
NetC48_2: C48.2 ; port CSI_CK_N
NetC59_1: C59.1 C60.1 C61.1 U4.14(CAP_VDD)
NetR17_2: R17.2 U4.10(XRES)
NetR18_2: R18.2 U4.31(MFP7)
NetR19_2: R19.2 U4.32(MFP8)
NetR21_2: R21.2 ; port 1V8_SENSE
NetR22_2: R22.2 ; port 1V2_SENSE
NetR23_1: R23.1 R24.2 ; port PoC_SENSE

Not connected (* = marked no-connect by the designer): D5 2(IO2)* 4(IO3)* 5(IO4)* 6(NC)* 7(NC)* 9(NC)*; U4 2(MFP0)* 7(VREF)* 17(MFP3)* 18(MFP4)* 21(MFP5)* 22(MFP6)*

### Layout directives
differential pair: X25_N, X25_P
differential pair; differential pair class CSI: CLK_N, CLK_P, DA0_N, DA0_P, DA1_N, DA1_P, DA2_N, DA2_P, DA3_N, DA3_P
differential pair; differential pair class 100DIFF: NetC41_2, NetC42_2, NetC43_2, NetC46_2, SIO_N, SIO_P
differential pair; differential pair class PRECSI: NetC35_2, NetC37_2, NetC38_2, NetC39_2, NetC47_2, NetC48_2
net class 50SINGLE: PoC_TAP

### Notes on the sheet
- GMSL Serializer
- COAX Output
- ESD PROT
- (near R25) I2C ADDR 0x80
- (near R25) TABLE 11
- (near R26) COAX TUNNEL MODE 3GBPS
- (near R26) TABLE 12
- DOUBLE CHECK MFP I/O TO MAKE SURE IT'S RIGHT. HERE WE NEED THE CONFIG LINE OF THE 96717 AS WELL AS THE CAMERA LINE OF THE 96717 SO THE REMOTE SIDE CAN CONFIGURE SERDES ON THE ADAS ECU
- 1V2 & 1V8 LDOs
- Maybe add switch + ldo if core current is high - it's 600mA on the 1V2 rail alone so yes
- MAYBE SWAP FOR PHYSICALLY SMALLER REGS

### Library data of the parts
C35-C49 C51 C53-C61 = CMP-001-00058-1: as C1 on sheet GMSL_DESERIALIZER; Min Operating Temperature: -55°C; Mounting Technology: Surface Mount; Pins: 2; Case/Package: 0402; RoHS Compliant: Yes; Max Operating Temperature: 85°C
C50 C52 = CMP-2006-02792-2: as C?#15 on sheet HDMI; Packaging: Tape and Reel; Voltage Rating (DC): 6.3V; Width: 0.031inch; Termination: SMD/SMT; Dielectric: X5R; Package Quantity: 4000; Voltage Rating: 6.3V; Capacitance: 10uF; Case/Package: 0603; Min Operating Temperature: -55°C; Voltage: 6.3V; Length: 1.6mm; Thickness: 0.035inch; Lead Free: Lead Free; Depth: 0.8mm; Case Code (Imperial): 0603; Max Operating Temperature: 85°C; Material: Ceramic; Height: 0.8mm; Tolerance: 20%; Mount: Surface Mount; REACH SVHC: No SVHC; Radiation Hardening: No; Case Code (Metric): 1608
D5 = CMP-04989-000002-1: as D?#1 on sheet HDMI; Ambient Temperature Range High: +125°C; ComponentLink2Description: Datasheet; Height: 0.55mm; Lead Free: Yes; Device Class L3: unset; Temperature Range High: +125°C; Temperature Range Low: -40°C; Package: DQA0010A; Temperature: -40°C to +125°C; Capacitance: 0.55pF; RoHS: TRUE; Mouser Description: 4-Channel Low-Capacitance Surge and ESD Protection Diode 10-USON -40 to 125; Category: Diode; Device Class L1: Circuit Protection; Octopart: https://octopart.com/esd204dqar-texas+instruments-89917476; Device Class L2: TVS Diodes; Ambient Temperature Range Low: -40°C; Manufacturer Part Number: ESD204DQAR; ComponentLink2URL: http://www.ti.com/lit/ds/symlink/esd204.pdf; Automotive: No; Digikey Description: 4-CHANNEL LOW-CAPACITANCE SURGE
R16 R17 R20-R29 = CMP-009-00002-14: Resistor
R18 R19 = CMP-009-00118-2: READ THE NAME; Pins: 2; Component Type: Standard; Design Item ID: CMP-009-00206-2; Source: 0402jump.SchLib
U4 = CMP-015-00012-1: 3Gbps Serializer TQFN-32 Serializers / Deserializers ROHS
U5 = CMP-0244-00308-1: as U2 on sheet GMSL_DESERIALIZER; ComponentLink1URL: http://www.st.com; PackageReference: SOT-223; PackageDescription: 4-Pin SOT-223 Package, 6.5 x 3.5 mm Body, 2.3 mm Pitch, 7 mm Lead Span; ComponentLink2URL: http://www.st.com/internet/com/TECHNICAL_RESOURCES/TECHNICAL_LITERATURE/DATASHEET/CD00000544.pdf; ComponentLink2Description: Datasheet; ComponentLink1Description: Manufacturer URL; DatasheetVersion: 1/11/2011; PackageVersion: 2010
U6 = CMP-0244-00318-1: as U3 on sheet GMSL_DESERIALIZER; PackageDescription: 4-Pin SOT-223 Package, 6.5 x 3.5 mm Body, 2.3 mm Pitch, 7 mm Lead Span; PackageVersion: 2010; ComponentLink2Description: Datasheet; PackageReference: SOT-223; ComponentLink2URL: http://www.st.com/internet/com/TECHNICAL_RESOURCES/TECHNICAL_LITERATURE/DATASHEET/CD00000544.pdf; ComponentLink1Description: Manufacturer URL; DatasheetVersion: 1/11/2011; ComponentLink1URL: http://www.st.com
Y2 = CMP-2000-05733-3: as Y1 on sheet GMSL_DESERIALIZER; Length: 3.2mm; Depth: 2.5mm; Packaging: Tape and Reel; Min Operating Temperature: -40°C; Operating Frequency: 25 MHz; Lead Free: Lead Free; Number of Pins: 4; Frequency Tolerance: 20ppm; Radiation Hardening: No; Max Operating Temperature: 85°C; Termination: SMD/SMT; Frequency Stability: 30ppm; Frequency: 25MHz; Series: ABM8G; Mount: Surface Mount; Package Quantity: 1000; Height: 0.039inch; Width: 0.098inch; Case/Package: CSMD; ESR (Equivalent Series Resistance): 60R; Load Capacitance: 18pF; Tolerance: 20ppm

## Nets that join several sheets
3V3_AUX: HDMI (R?#31.2 R?#38.1 U?#1.4), GMSL_DESERIALIZER (10 pins), GMSL_SERIALIZER (10 pins)
GND: HDMI (24 pins), GMSL_DESERIALIZER (43 pins), GMSL_SERIALIZER (28 pins)
CONF_SCL: GMSL_DESERIALIZER (U1.29), GMSL_SERIALIZER (R19.1 U4.6)
CONF_SDA: GMSL_DESERIALIZER (U1.28), GMSL_SERIALIZER (R18.1 U4.5)
nPWDN: GMSL_DESERIALIZER (R2.1 U1.11), GMSL_SERIALIZER (R20.1 U4.1)